# EAGLE design Bidirectional_Amp (EAGLE 9.5.1)

## Sheet 1 of 6: TX/RX Control
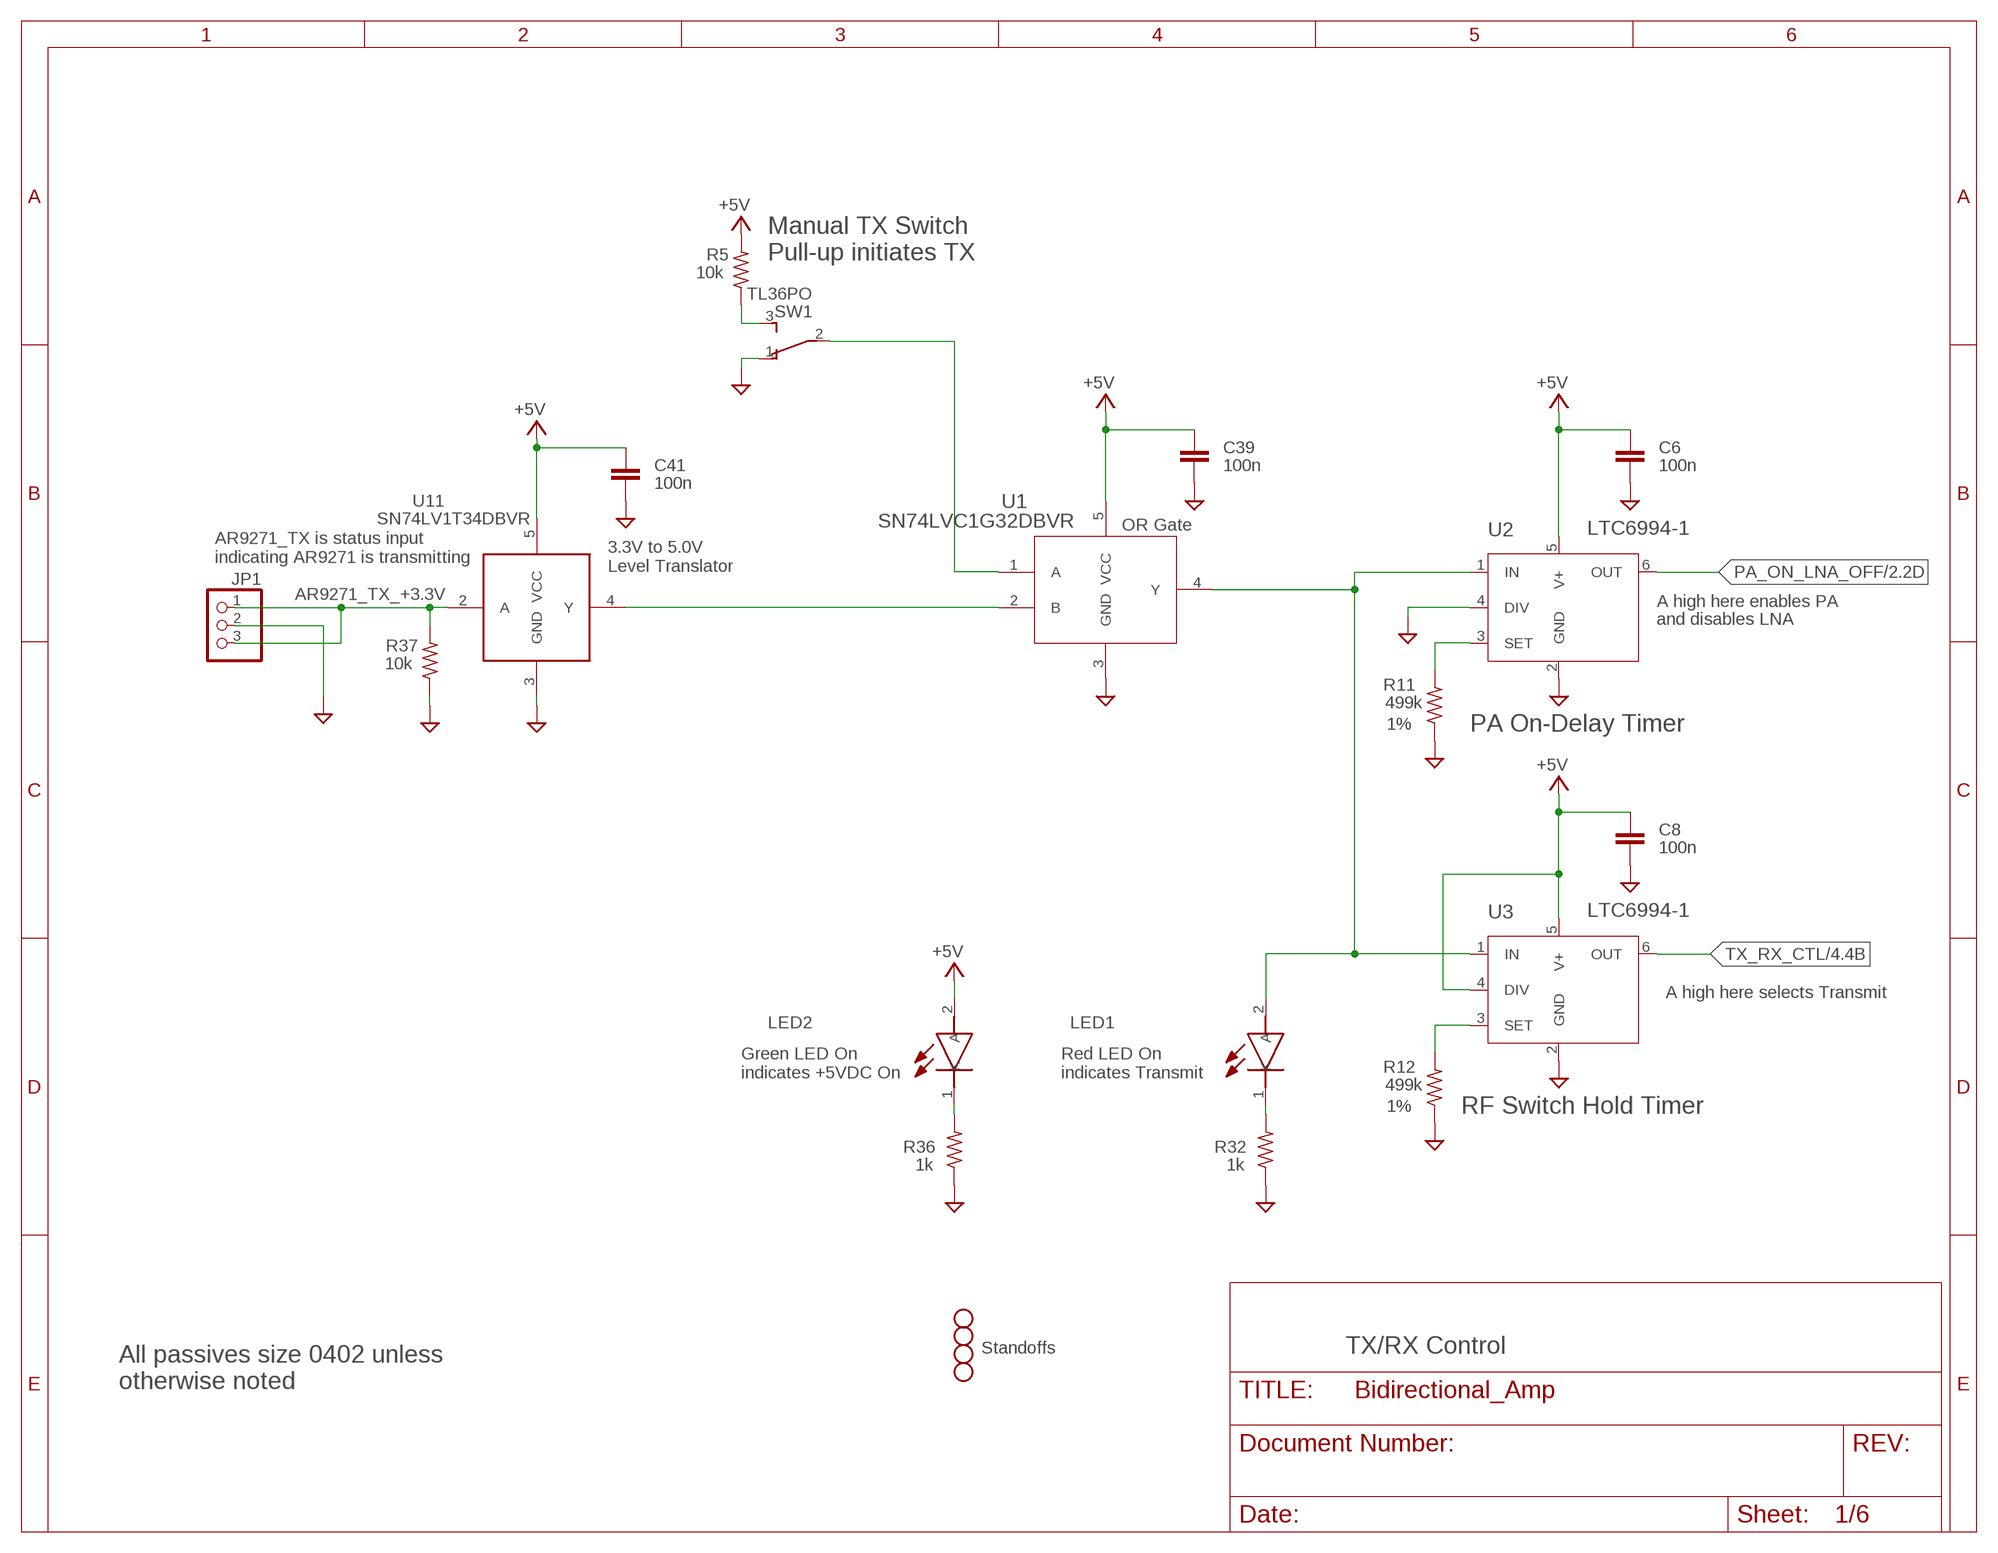
[diagram p0: schematic, sheet 1]

### Parts
C6  100n  C-EU0402-B-NOSILK  [.0402-B-NOSILK]
C8  100n  C-EU0402-B-NOSILK  [.0402-B-NOSILK]
C39  100n  C-EU0402-B-NOSILK  [.0402-B-NOSILK]
C41  100n  C-EU0402-B-NOSILK  [.0402-B-NOSILK]
H1  STAND-OFFTIGHT  [STAND-OFF-TIGHT]
H2  STAND-OFFTIGHT  [STAND-OFF-TIGHT]
H3  STAND-OFFTIGHT  [STAND-OFF-TIGHT]
H4  STAND-OFFTIGHT  [STAND-OFF-TIGHT]
JP1  PINHD-1X3  [1X03]
LED1  LTST-C193KRKT-5A  [LEDC1607X80N]
LED2  LTST-C193KGKT-5A  [LEDC1607X80N]
R5  10k  R-US_0402-B-NOSILK  [.0402-B-NOSILK]
R11  499k  R-US_0402-B-NOSILK  [.0402-B-NOSILK]
R12  499k  R-US_0402-B-NOSILK  [.0402-B-NOSILK]
R32  1k  R-US_0402-B-NOSILK  [.0402-B-NOSILK]
R36  1k  R-US_0402-B-NOSILK  [.0402-B-NOSILK]
R37  10k  R-US_0402-B-NOSILK  [.0402-B-NOSILK]
SW1  TL36PO  [TL3XPO]
U1  SN74LVC1G32DBVR  [DBV5]
U2  LTC6994-1  LTC6994CS6-1PBF  [TSOT-23_S6]
U3  LTC6994-1  LTC6994CS6-1PBF  [TSOT-23_S6]
U11  SN74LV1T34DBVR  [SOT95P280X145-5N]

### Nets
+5V: C6.1 C8.1 C39.1 C41.1 LED2.2(A) R5.2 U1.5(VCC) U2.5(V+) U3.4(DIV) U3.5(V+) U11.5(VCC) ; also sheet 2,3,4,5,6
AR9271_TX_+3.3V: JP1.1 JP1.3 R37.2 U11.2(A)
GND: C6.2 C8.2 C39.2 C41.2 JP1.2 R11.1 R12.1 R32.1 R36.1 R37.1 SW1.1(O) U1.3(GND) U2.2(GND) U2.4(DIV) U3.2(GND) U11.3(GND) ; also sheet 2,3,4,5,6
N$3: R5.1 SW1.3(S)
N$5: SW1.2(P) U1.1(A)
N$10: LED1.2(A) U1.4(Y) U2.1(IN) U3.1(IN)
N$11: R11.2 U2.3(SET)
N$13: U1.2(B) U11.4(Y)
N$14: R12.2 U3.3(SET)
N$15: LED1.1(K) R32.2
N$51: LED2.1(K) R36.2
PA_ON_LNA_OFF: U2.6(OUT) ; also sheet 2,3
TX_RX_CTL: U3.6(OUT) ; also sheet 4

### Notes on the sheet
- Manual TX Switch
  Pull-up initiates TX
- OR Gate
- AR9271_TX is status input
  indicating AR9271 is transmitting
- 3.3V to 5.0V
  Level Translator
- A high here enables PA
- and disables LNA
- 1% | PA On-Delay Timer
- A high here selects Transmit
- Green LED On
  indicates +5VDC On
- Red LED On
  indicates Transmit
- 1% | RF Switch Hold Timer
- Standoffs | TX/RX Control
- All passives size 0402 unless
  otherwise noted

## Sheet 2 of 6: Power Amplifier
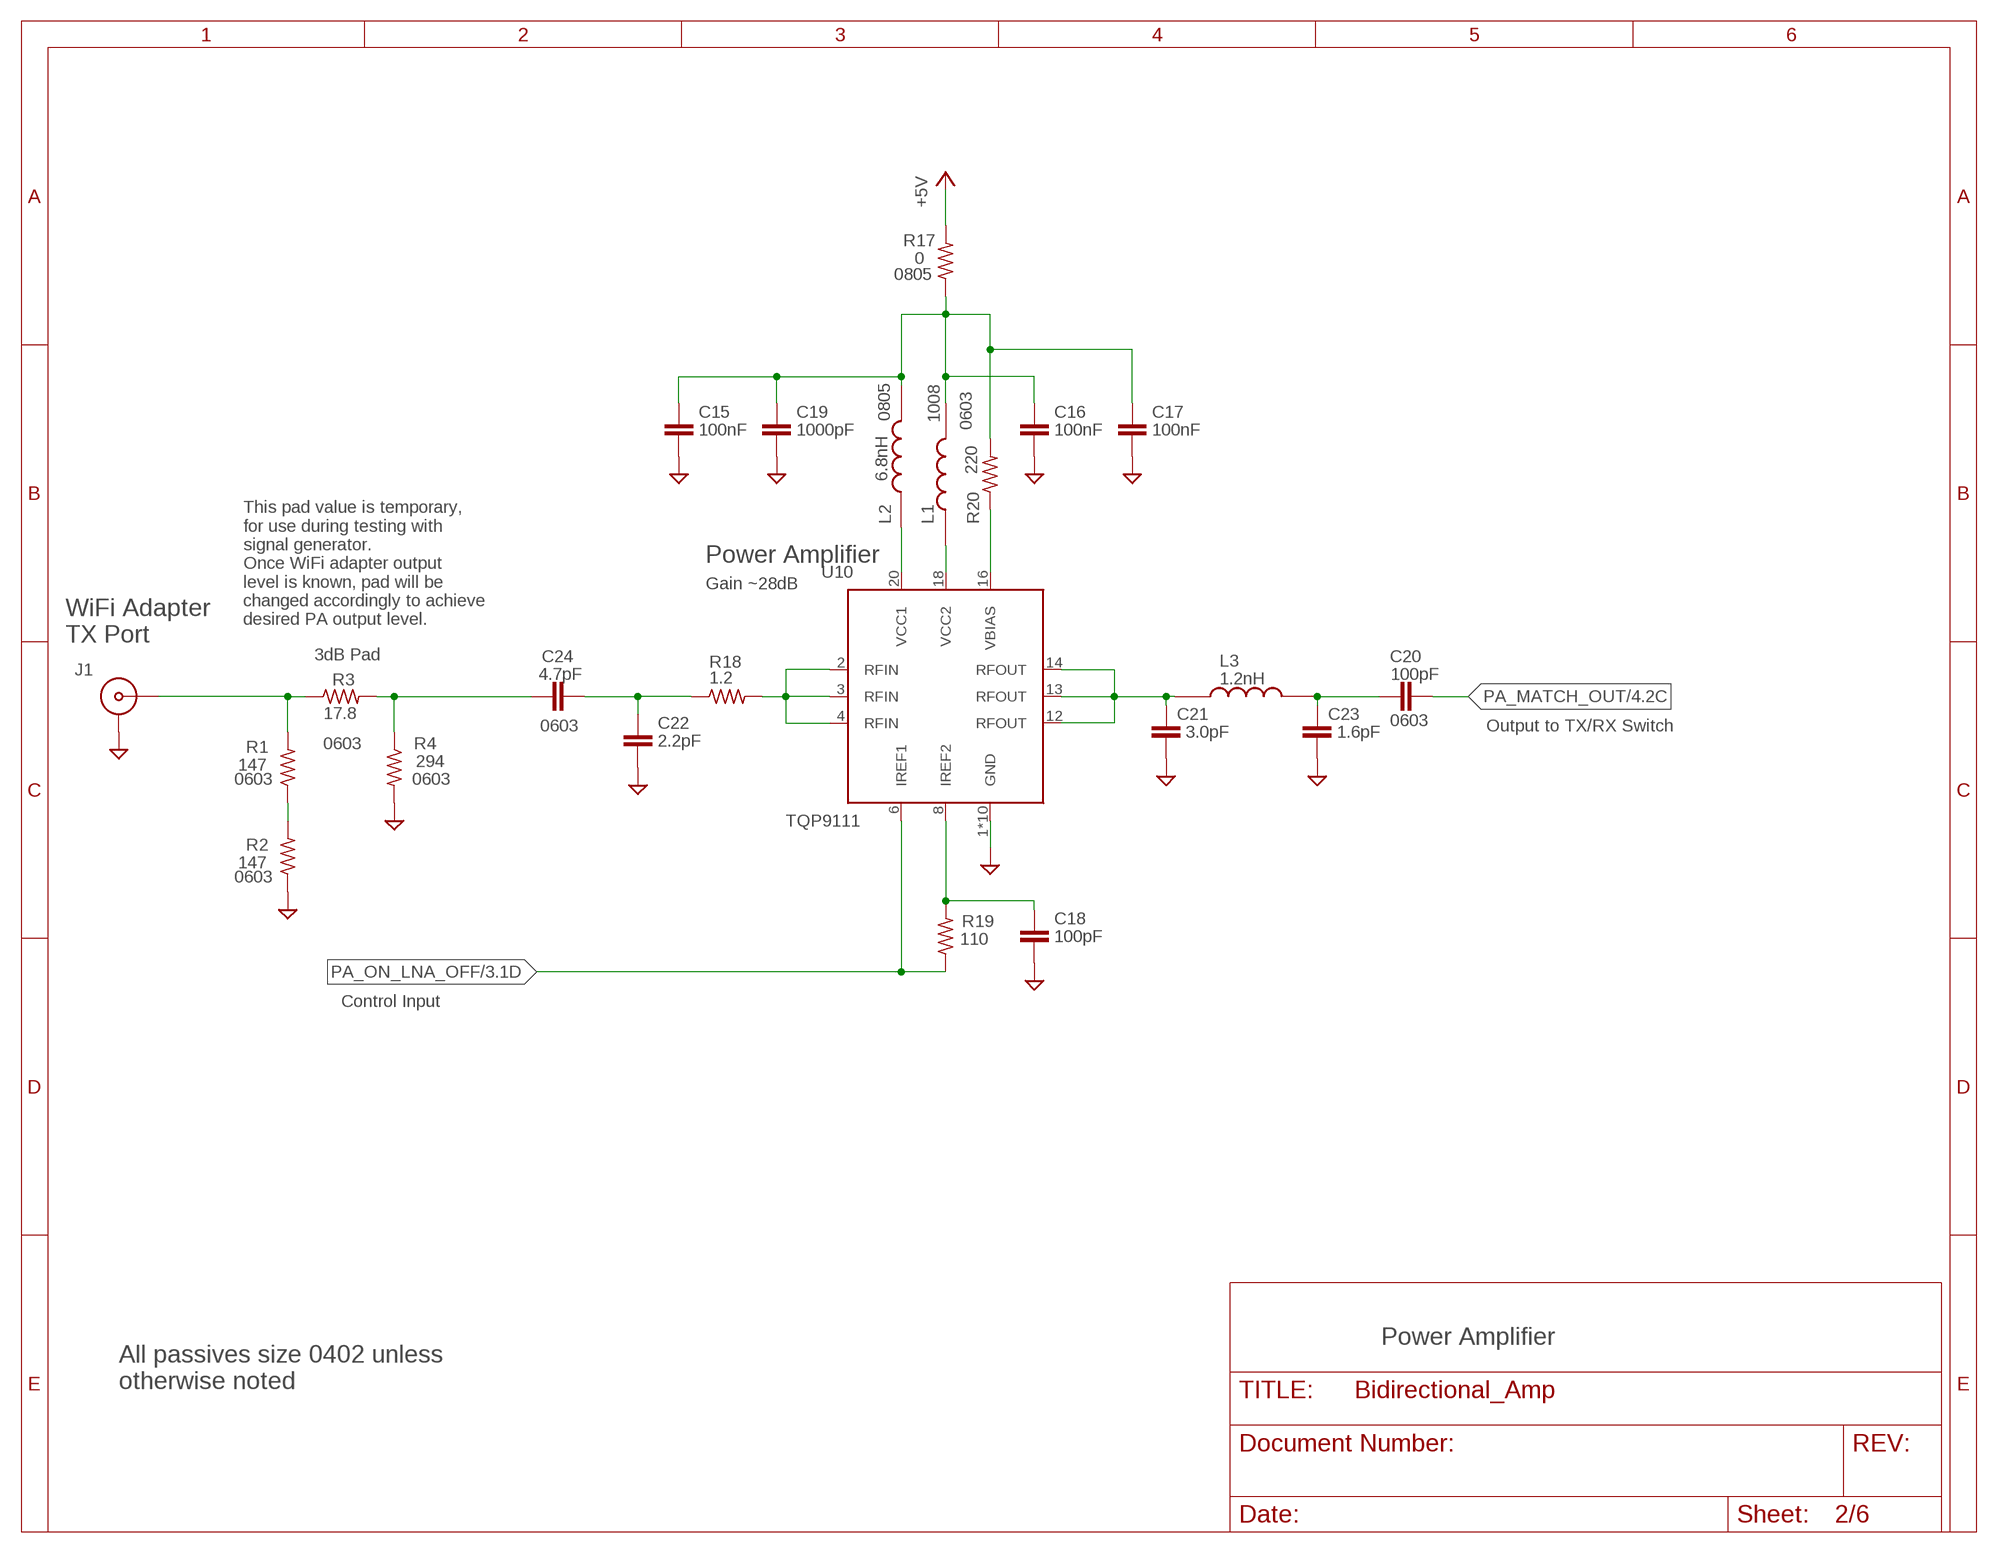
[diagram p1: schematic, sheet 2]

### Parts
C15  100nF  C-EU0402-B-NOSILK  [.0402-B-NOSILK]
C16  100nF  C-EU0402-B-NOSILK  [.0402-B-NOSILK]
C17  100nF  C-EU0402-B-NOSILK  [.0402-B-NOSILK]
C18  100pF  C-EU0402-B-NOSILK  [.0402-B-NOSILK]
C19  1000pF  C-EU0402-B-NOSILK  [.0402-B-NOSILK]
C20  100pF  C-EU0603-C-NOSILK  [.0603-C-NOSILK]
C21  3.0pF  C-EU0402-C-NOSILK  [.0402-C-NOSILK]
C22  2.2pF  C-EU0402-C-NOSILK  [.0402-C-NOSILK]
C23  1.6pF  C-EU0402-C-NOSILK  [.0402-C-NOSILK]
C24  4.7pF  C-EU0603-C-NOSILK  [.0603-C-NOSILK]
J1  142-0701-851_ALT  [142-0701-851]
L1  1008HQ-10NXJLB1008_IMPERIAL_2520_METRIC  [INDC2520X120N]
L2  6.8nH  0805CS-060XJLC  [0805CS]
L3  1.2nH  0402CS-1N2XJLW  [0402CS1N2XJLW]
R1  147  R-US_0603-C-NOSILK  [.0603-C-NOSILK]
R2  147  R-US_0603-C-NOSILK  [.0603-C-NOSILK]
R3  17.8  R-US_0603-C-NOSILK  [.0603-C-NOSILK]
R4  294  R-US_0603-C-NOSILK  [.0603-C-NOSILK]
R17  0  R-US_R0805  [R0805]
R18  1.2  R-US_R0402  [R0402]
R19  110  R-US_0402-B-NOSILK  [.0402-B-NOSILK]
R20  220  R-US_0603-C-NOSILK  [.0603-C-NOSILK]
U10  TQP9111  [QFN50P400X400X102-21N]

### Nets
+5V: R17.2 ; also sheet 1,3,4,5,6
GND: C15.2 C16.2 C17.2 C18.2 C19.2 C21.2 C22.2 C23.2 J1.GND1(GND) J1.GND2(GND) J1.GND3(GND) J1.GND4(GND) R2.1 R4.2 U10.1(GND) U10.5(GND) U10.7(GND) U10.9(GND) U10.10(GND) U10.11(GND) U10.15(GND) U10.17(GND) U10.19(GND) U10.21(GND) ; also sheet 1,3,4,5,6
N$2 [RF]: J1.RF1(CTR) R1.2 R3.1
N$4: R1.1 R2.2
N$16: L1.1 U10.18(VCC2)
N$21: C15.1 C16.1 C17.1 C19.1 L1.2 L2.2 R17.1 R20.2
N$22: C18.1 R19.2 U10.8(IREF2)
N$24 [RF]: C21.1 L3.1 U10.12(RFOUT) U10.13(RFOUT) U10.14(RFOUT)
N$25 [RF]: C22.1 C24.2 R18.1
N$27 [RF]: C20.1 C23.1 L3.2
N$30: R20.1 U10.16(VBIAS)
N$31: L2.1 U10.20(VCC1)
N$56 [RF]: R18.2 U10.2(RFIN) U10.3(RFIN) U10.4(RFIN)
PA_MATCH_OUT [RF]: C20.2 ; also sheet 4
PA_ON_LNA_OFF: R19.1 U10.6(IREF1) ; also sheet 1,3
PA_PAD_OUT [RF]: C24.1 R3.2 R4.1

### Notes on the sheet
- 0805
- 0805 | 1008
- 0603
- Power Amplifier
- Gain ~28dB
- This pad value is temporary,
  for use during testing with
  signal generator.
  Once WiFi adapter output
  level is known, pad will be
  changed accordingly to achieve
  desired PA output level.
- WiFi Adapter
  TX Port
- 3dB Pad
- 0603
- 0603 | Output to TX/RX Switch
- 0603
- 0603 | 0603
- 0603
- Control Input
- Power Amplifier
- All passives size 0402 unless
  otherwise noted

## Sheet 3 of 6: LNA and RX Bandpass Filters
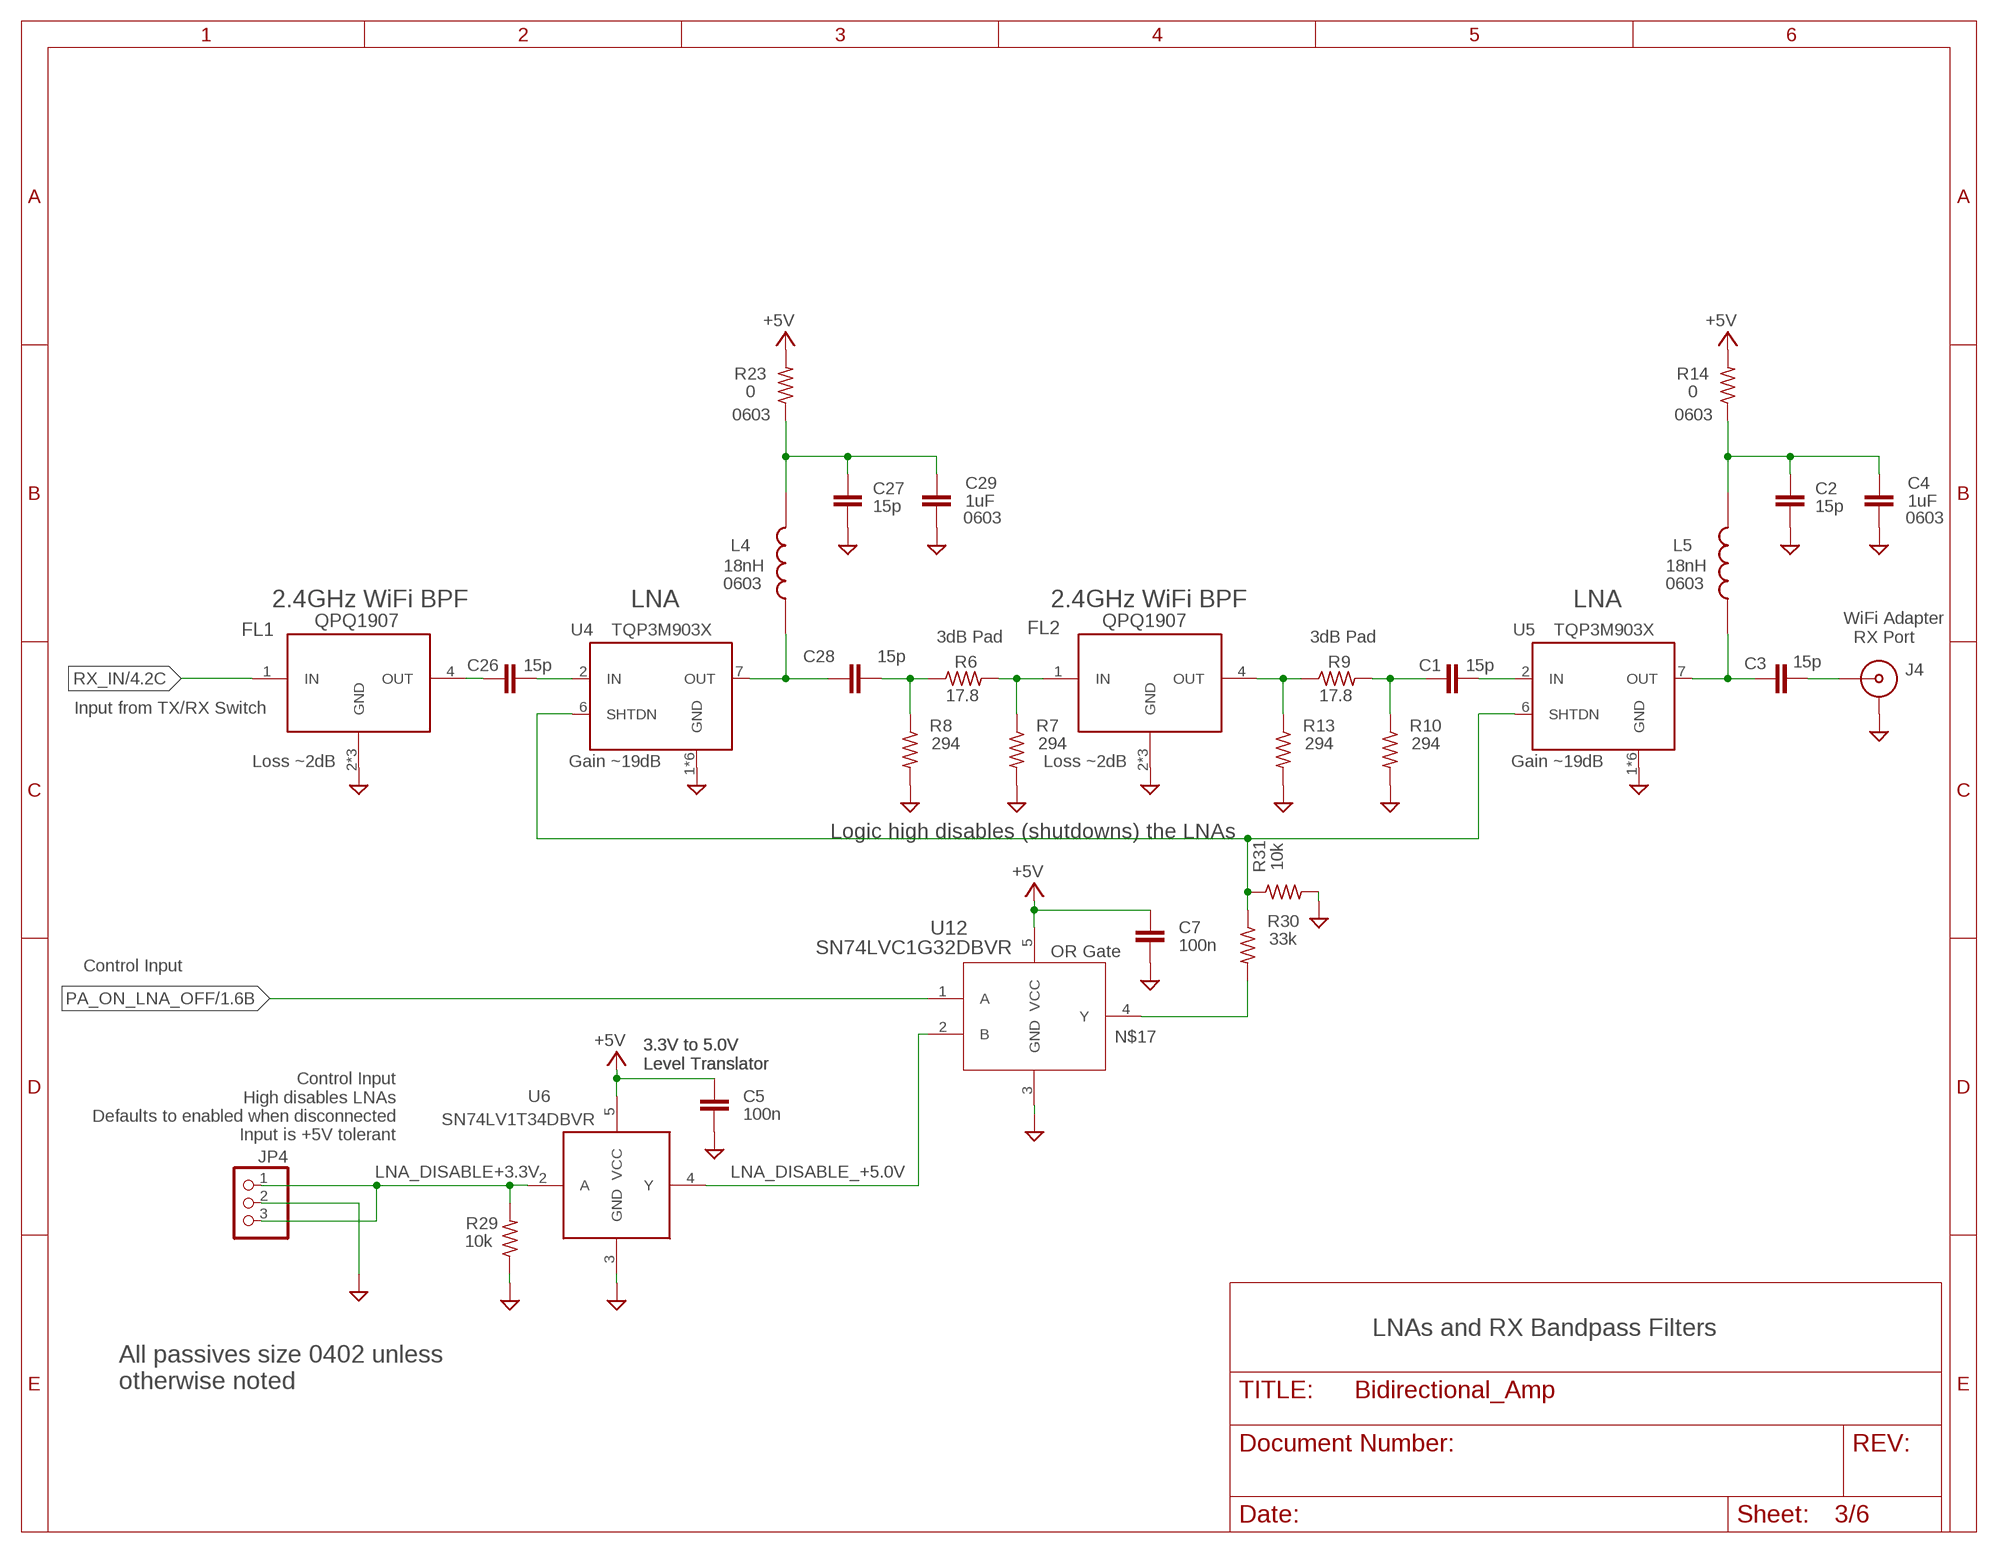
[diagram p2: schematic, sheet 3]

### Parts
C1  15p  C-EU0402-C-NOSILK  [.0402-C-NOSILK]
C2  15p  C-EU0402-B-NOSILK  [.0402-B-NOSILK]
C3  15p  C-EU0402-C-NOSILK  [.0402-C-NOSILK]
C4  1uF  C-EU0603-B-NOSILK  [.0603-B-NOSILK]
C5  100n  C-EU0402-B-NOSILK  [.0402-B-NOSILK]
C7  100n  C-EU0402-B-NOSILK  [.0402-B-NOSILK]
C26  15p  C-EU0402-C-NOSILK  [.0402-C-NOSILK]
C27  15p  C-EU0402-B-NOSILK  [.0402-B-NOSILK]
C28  15p  C-EU0402-C-NOSILK  [.0402-C-NOSILK]
C29  1uF  C-EU0603-B-NOSILK  [.0603-B-NOSILK]
FL1  QPQ1907  [FIL_B39162B9417K610]
FL2  QPQ1907  [FIL_B39162B9417K610]
J4  142-0701-851_ALT  [142-0701-851]
JP4  PINHD-1X3  [1X03]
L4  68nH  0603CS-68NXJLW  [0603CS-68NXJLW]
L5  68nH  0603CS-68NXJLW  [0603CS-68NXJLW]
R6  17.8  R-US_0402-C-NOSILK  [.0402-C-NOSILK]
R7  294  R-US_0402-C-NOSILK  [.0402-C-NOSILK]
R8  294  R-US_0402-C-NOSILK  [.0402-C-NOSILK]
R9  17.8  R-US_0402-C-NOSILK  [.0402-C-NOSILK]
R10  294  R-US_0402-C-NOSILK  [.0402-C-NOSILK]
R13  294  R-US_0402-C-NOSILK  [.0402-C-NOSILK]
R14  0  R-US_0603-B-NOSILK  [.0603-B-NOSILK]
R23  0  R-US_0603-B-NOSILK  [.0603-B-NOSILK]
R29  10k  R-US_0402-B-NOSILK  [.0402-B-NOSILK]
R30  33k  R-US_0402-B-NOSILK  [.0402-B-NOSILK]
R31  10k  R-US_0402-B-NOSILK  [.0402-B-NOSILK]
U4  TQP3M903X  [DFN8-2X2-WITH-PAD]
U5  TQP3M903X  [DFN8-2X2-WITH-PAD]
U6  SN74LV1T34DBVR  [SOT95P280X145-5N]
U12  SN74LVC1G32DBVR  [DBV5]

### Nets
+5V: C5.1 C7.1 R14.2 R23.2 U6.5(VCC) U12.5(VCC) ; also sheet 1,2,4,5,6
GND: C2.1 C4.2 C5.2 C7.2 C27.1 C29.2 FL1.2(GND) FL1.3(GND) FL1.5(GND) FL2.2(GND) FL2.3(GND) FL2.5(GND) J4.GND1(GND) J4.GND2(GND) J4.GND3(GND) J4.GND4(GND) JP4.2 R7.2 R8.2 R10.2 R13.2 R29.1 R31.2 U4.1(GND) U4.3(GND) U4.4(GND) U4.5(GND) U4.8(GND) U4.PAD(GND) U5.1(GND) U5.3(GND) U5.4(GND) U5.5(GND) U5.8(GND) U5.PAD(GND) U6.3(GND) U12.3(GND) ; also sheet 1,2,4,5,6
LNA_DISABLE+3.3V: JP4.1 JP4.3 R29.2 U6.2(A)
LNA_DISABLE_+5.0V: U6.4(Y) U12.2(B)
LNA_ON_OFF: R30.1 R31.1 U4.6(SHTDN) U5.6(SHTDN)
N$1 [RF]: C28.2 R6.1 R8.1
N$6 [RF]: FL2.4(OUT) R9.1 R13.1
N$7 [RF]: C1.2 U5.2(IN)
N$8 [RF]: C3.1 L5.1 U5.7(OUT)
N$9: C2.2 C4.1 L5.2 R14.1
N$12 [RF]: C3.2 J4.RF1(CTR)
N$17: R30.2 U12.4(Y)
N$26 [RF]: C26.2 U4.2(IN)
N$28 [RF]: C28.1 L4.1 U4.7(OUT)
N$29: C27.2 C29.1 L4.2 R23.1
N$33 [RF]: C26.1 FL1.4(OUT)
PA_ON_LNA_OFF: U12.1(A) ; also sheet 1,2
PA_PAD_OUT1 [RF]: FL2.1(IN) R6.2 R7.1
PA_PAD_OUT2 [RF]: C1.1 R9.2 R10.1
RX_IN [RF]: FL1.1(IN) ; also sheet 4

### Notes on the sheet
- 0603 | 0603
- 0603 | 0603
- 18nH | 18nH
- 0603 | 0603
- 2.4GHz WiFi BPF | LNA | 2.4GHz WiFi BPF | LNA
- 3dB Pad | 3dB Pad
- WiFi Adapter
    RX Port
- Input from TX/RX Switch
- Loss ~2dB | Gain ~19dB | Loss ~2dB | Gain ~19dB
- Logic high disables (shutdowns) the LNAs
- OR Gate
- Control Input
- 3.3V to 5.0V
  Level Translator
- 3.3V to 5.0V
  Level Translator
- Control Input
  High disables LNAs
  Defaults to enabled when disconnected
  Input is +5V tolerant
- LNAs and RX Bandpass Filters
- All passives size 0402 unless
  otherwise noted

## Sheet 4 of 6: TX/RX Switch
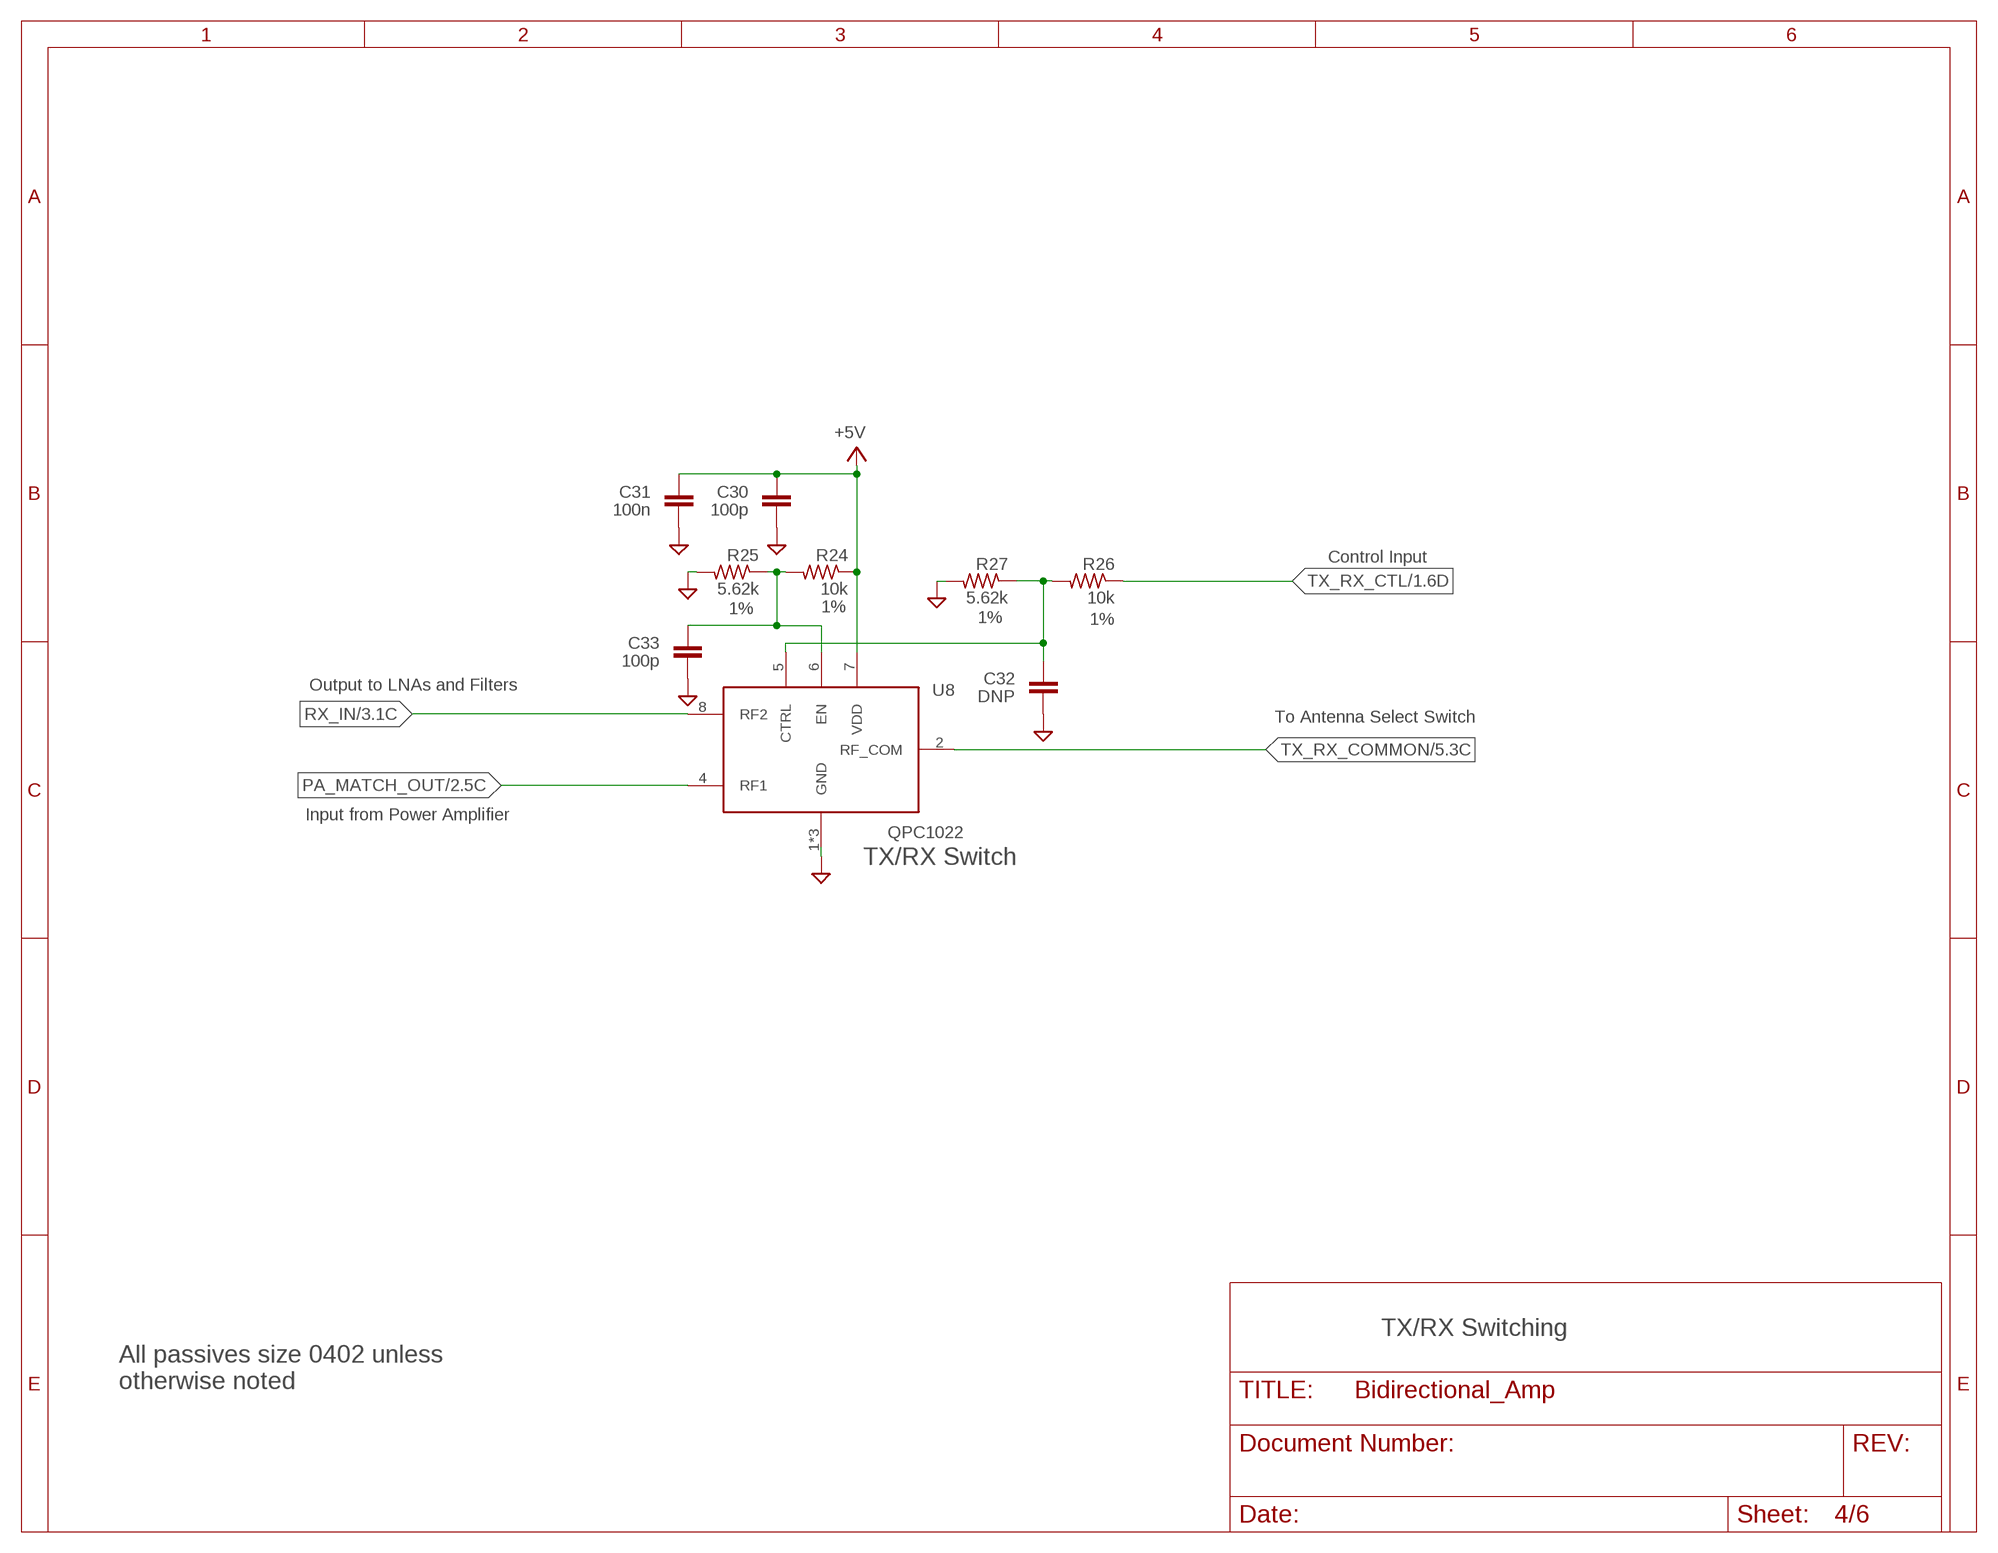
[diagram p3: schematic, sheet 4]

### Parts
C30  100p  C-EU0402-B-NOSILK  [.0402-B-NOSILK]
C31  100n  C-EU0402-B-NOSILK  [.0402-B-NOSILK]
C32  DNP  C-EU0402-B-NOSILK  [.0402-B-NOSILK]
C33  100p  C-EU0402-B-NOSILK  [.0402-B-NOSILK]
R24  10k  R-US_0402-B-NOSILK  [.0402-B-NOSILK]
R25  5.62k  R-US_0402-B-NOSILK  [.0402-B-NOSILK]
R26  10k  R-US_0402-B-NOSILK  [.0402-B-NOSILK]
R27  5.62k  R-US_0402-B-NOSILK  [.0402-B-NOSILK]
U8  QPC1022  [QPC1022]

### Nets
+5V: C30.1 C31.1 R24.1 U8.7(VDD) ; also sheet 1,2,3,5,6
GND: C30.2 C31.2 C32.2 C33.2 R25.2 R27.2 U8.1(GND) U8.3(GND) U8.9(GND) ; also sheet 1,2,3,5,6
PA_MATCH_OUT [RF]: U8.4(RF1) ; also sheet 2
RX_IN [RF]: U8.8(RF2) ; also sheet 3
TX_RX_COMMON [RF]: U8.2(RF_COM) ; also sheet 5
TX_RX_CTL: R26.1 ; also sheet 1
TXRX-CTRL: C32.1 R26.2 R27.1 U8.5(CTRL)
TXRX-EN: C33.1 R24.2 R25.1 U8.6(EN)

### Notes on the sheet
- Control Input
- 1% | 1%
- 1% | 1%
- Output to LNAs and Filters
- To Antenna Select Switch
- Input from Power Amplifier
- TX/RX Switch
- TX/RX Switching
- All passives size 0402 unless
  otherwise noted

## Sheet 5 of 6: Antenna Select Switch
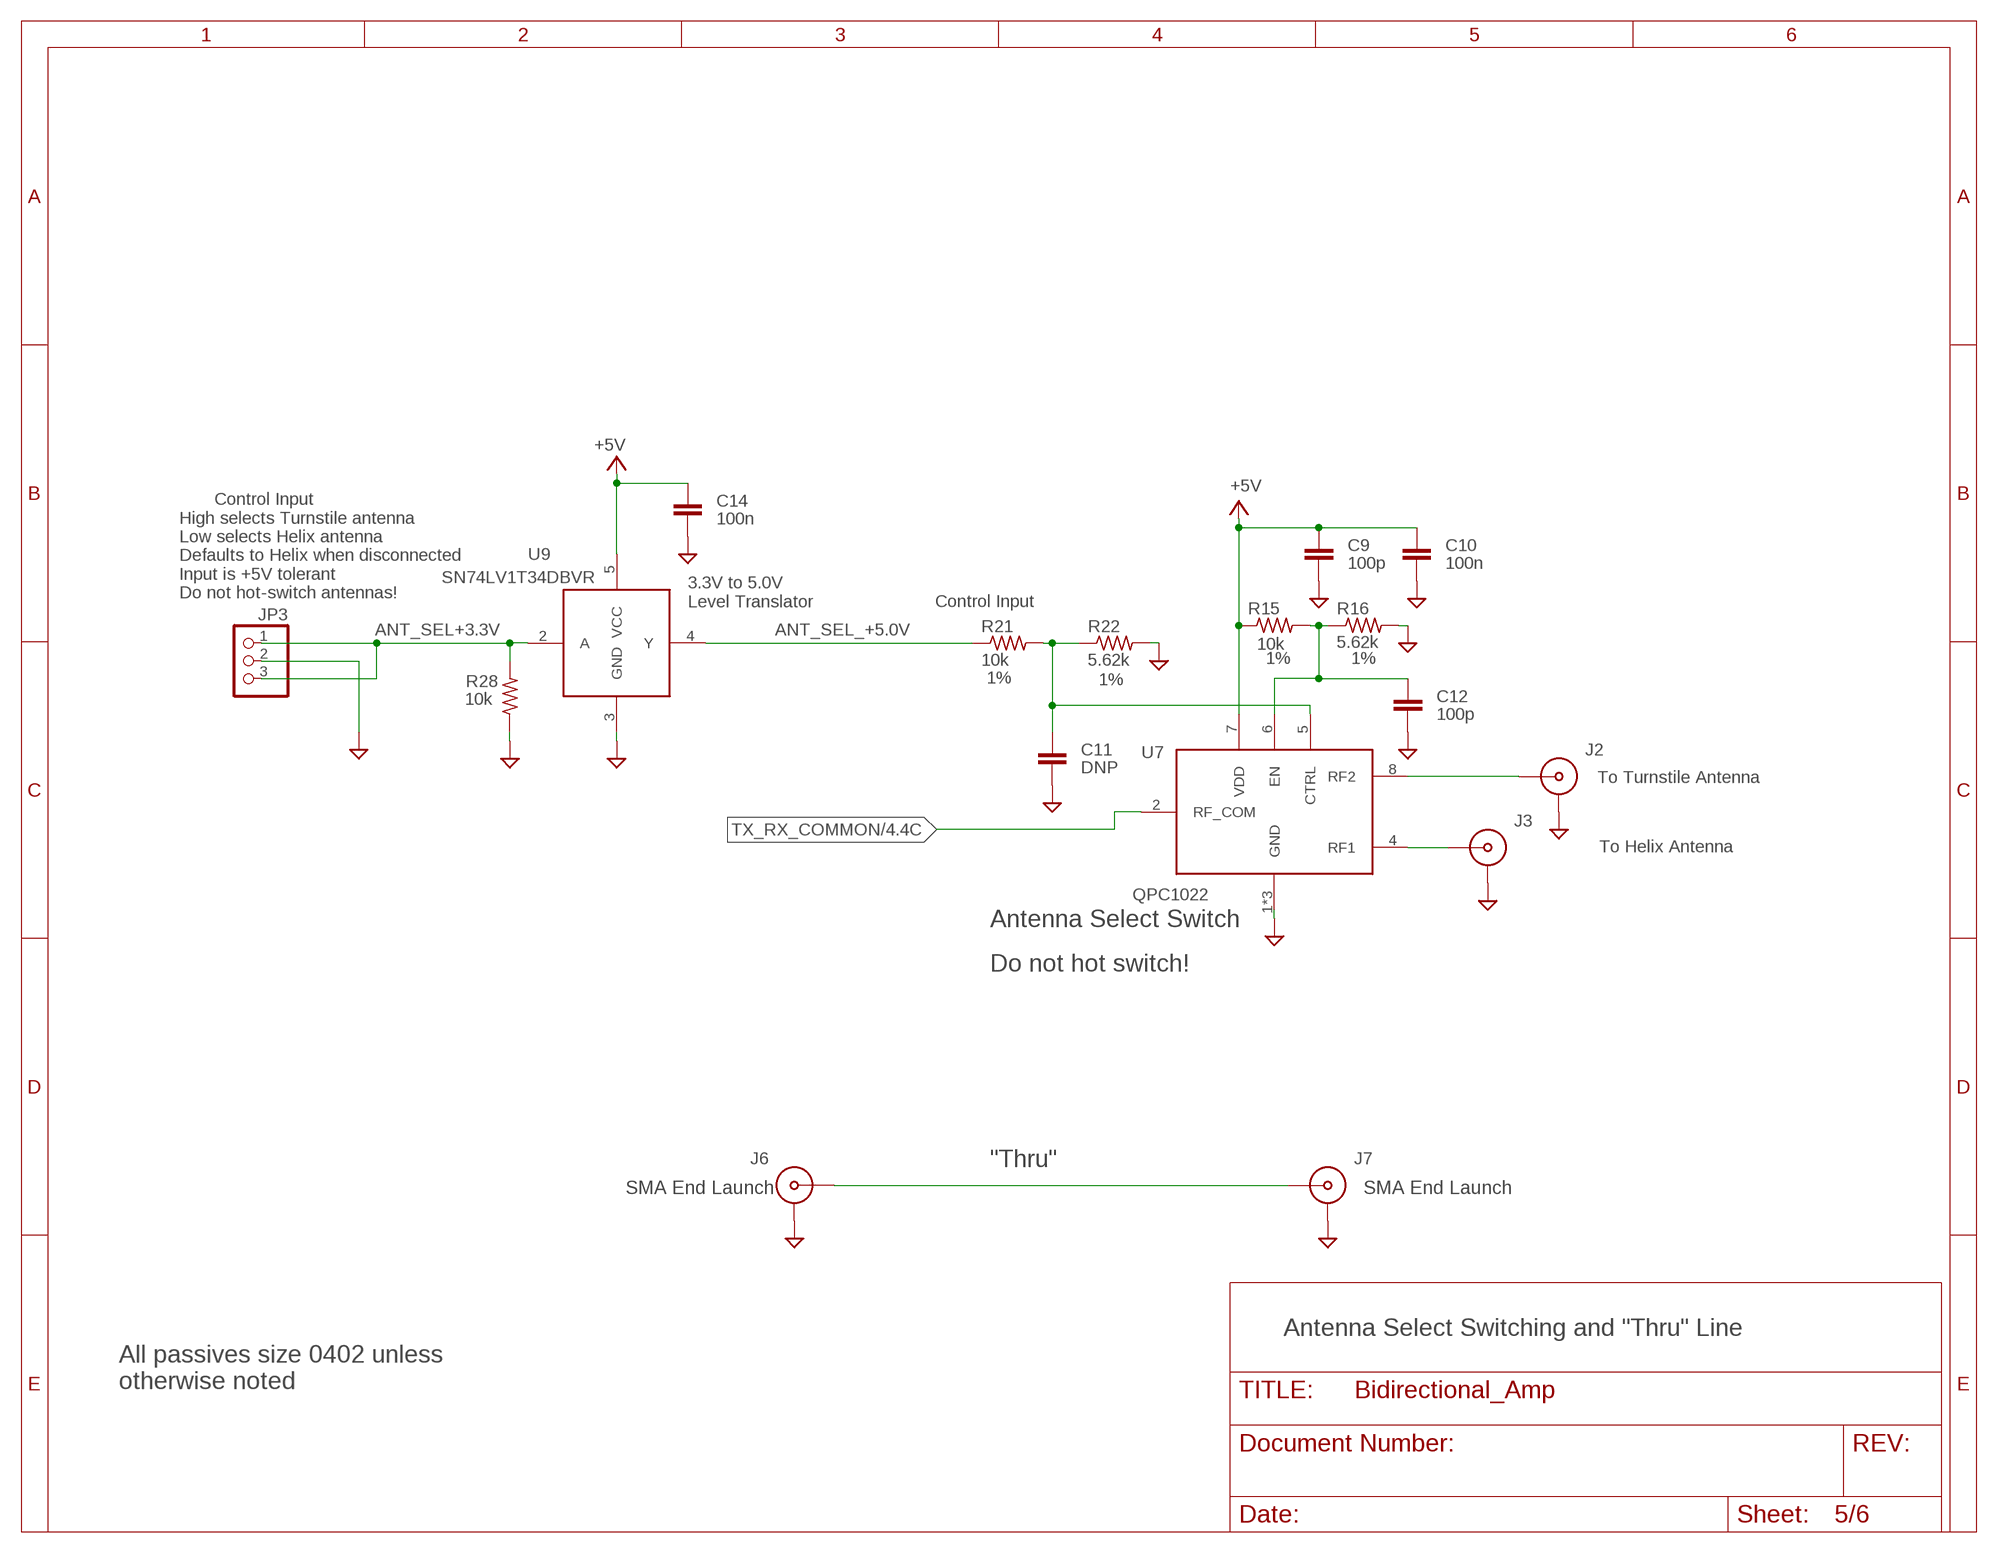
[diagram p4: schematic, sheet 5]

### Parts
C9  100p  C-EU0402-B-NOSILK  [.0402-B-NOSILK]
C10  100n  C-EU0402-B-NOSILK  [.0402-B-NOSILK]
C11  DNP  C-EU0402-B-NOSILK  [.0402-B-NOSILK]
C12  100p  C-EU0402-B-NOSILK  [.0402-B-NOSILK]
C14  100n  C-EU0402-B-NOSILK  [.0402-B-NOSILK]
J2  142-0701-851_ALT  [142-0701-851]
J3  142-0701-851_ALT  [142-0701-851]
J6  142-0701-851_ALT  [142-0701-851]
J7  142-0701-851_ALT  [142-0701-851]
JP3  PINHD-1X3  [1X03]
R15  10k  R-US_0402-B-NOSILK  [.0402-B-NOSILK]
R16  5.62k  R-US_0402-B-NOSILK  [.0402-B-NOSILK]
R21  10k  R-US_0402-B-NOSILK  [.0402-B-NOSILK]
R22  5.62k  R-US_0402-B-NOSILK  [.0402-B-NOSILK]
R28  10k  R-US_0402-B-NOSILK  [.0402-B-NOSILK]
U7  QPC1022  [QPC1022]
U9  SN74LV1T34DBVR  [SOT95P280X145-5N]

### Nets
+5V: C9.1 C10.1 C14.1 R15.1 U7.7(VDD) U9.5(VCC) ; also sheet 1,2,3,4,6
ANT_SEL+3.3V: JP3.1 JP3.3 R28.2 U9.2(A)
ANT_SEL_+5.0V: R21.1 U9.4(Y)
AS-CTRL: C11.1 R21.2 R22.1 U7.5(CTRL)
AS-EN: C12.1 R15.2 R16.1 U7.6(EN)
GND: C9.2 C10.2 C11.2 C12.2 C14.2 J2.GND1(GND) J2.GND2(GND) J2.GND3(GND) J2.GND4(GND) J3.GND1(GND) J3.GND2(GND) J3.GND3(GND) J3.GND4(GND) J6.GND1(GND) J6.GND2(GND) J6.GND3(GND) J6.GND4(GND) J7.GND1(GND) J7.GND2(GND) J7.GND3(GND) J7.GND4(GND) JP3.2 R16.2 R22.2 R28.1 U7.1(GND) U7.3(GND) U7.9(GND) U9.3(GND) ; also sheet 1,2,3,4,6
HELICAL [RF]: J2.RF1(CTR) U7.8(RF2)
THROUGH [RF]: J6.RF1(CTR) J7.RF1(CTR)
TURNSTILE [RF]: J3.RF1(CTR) U7.4(RF1)
TX_RX_COMMON [RF]: U7.2(RF_COM) ; also sheet 4

### Notes on the sheet
- Control Input
  High selects Turnstile antenna
  Low selects Helix antenna
  Defaults to Helix when disconnected
  Input is +5V tolerant
  Do not hot-switch antennas!
- 3.3V to 5.0V
  Level Translator
- Control Input
- 1% | 1%
- 1% | 1%
- To Turnstile Antenna
- To Helix Antenna
- Antenna Select Switch
- Do not hot switch!
- "Thru"
- SMA End Launch | SMA End Launch
- Antenna Select Switching and "Thru" Line
- All passives size 0402 unless
  otherwise noted

## Sheet 6 of 6: Power
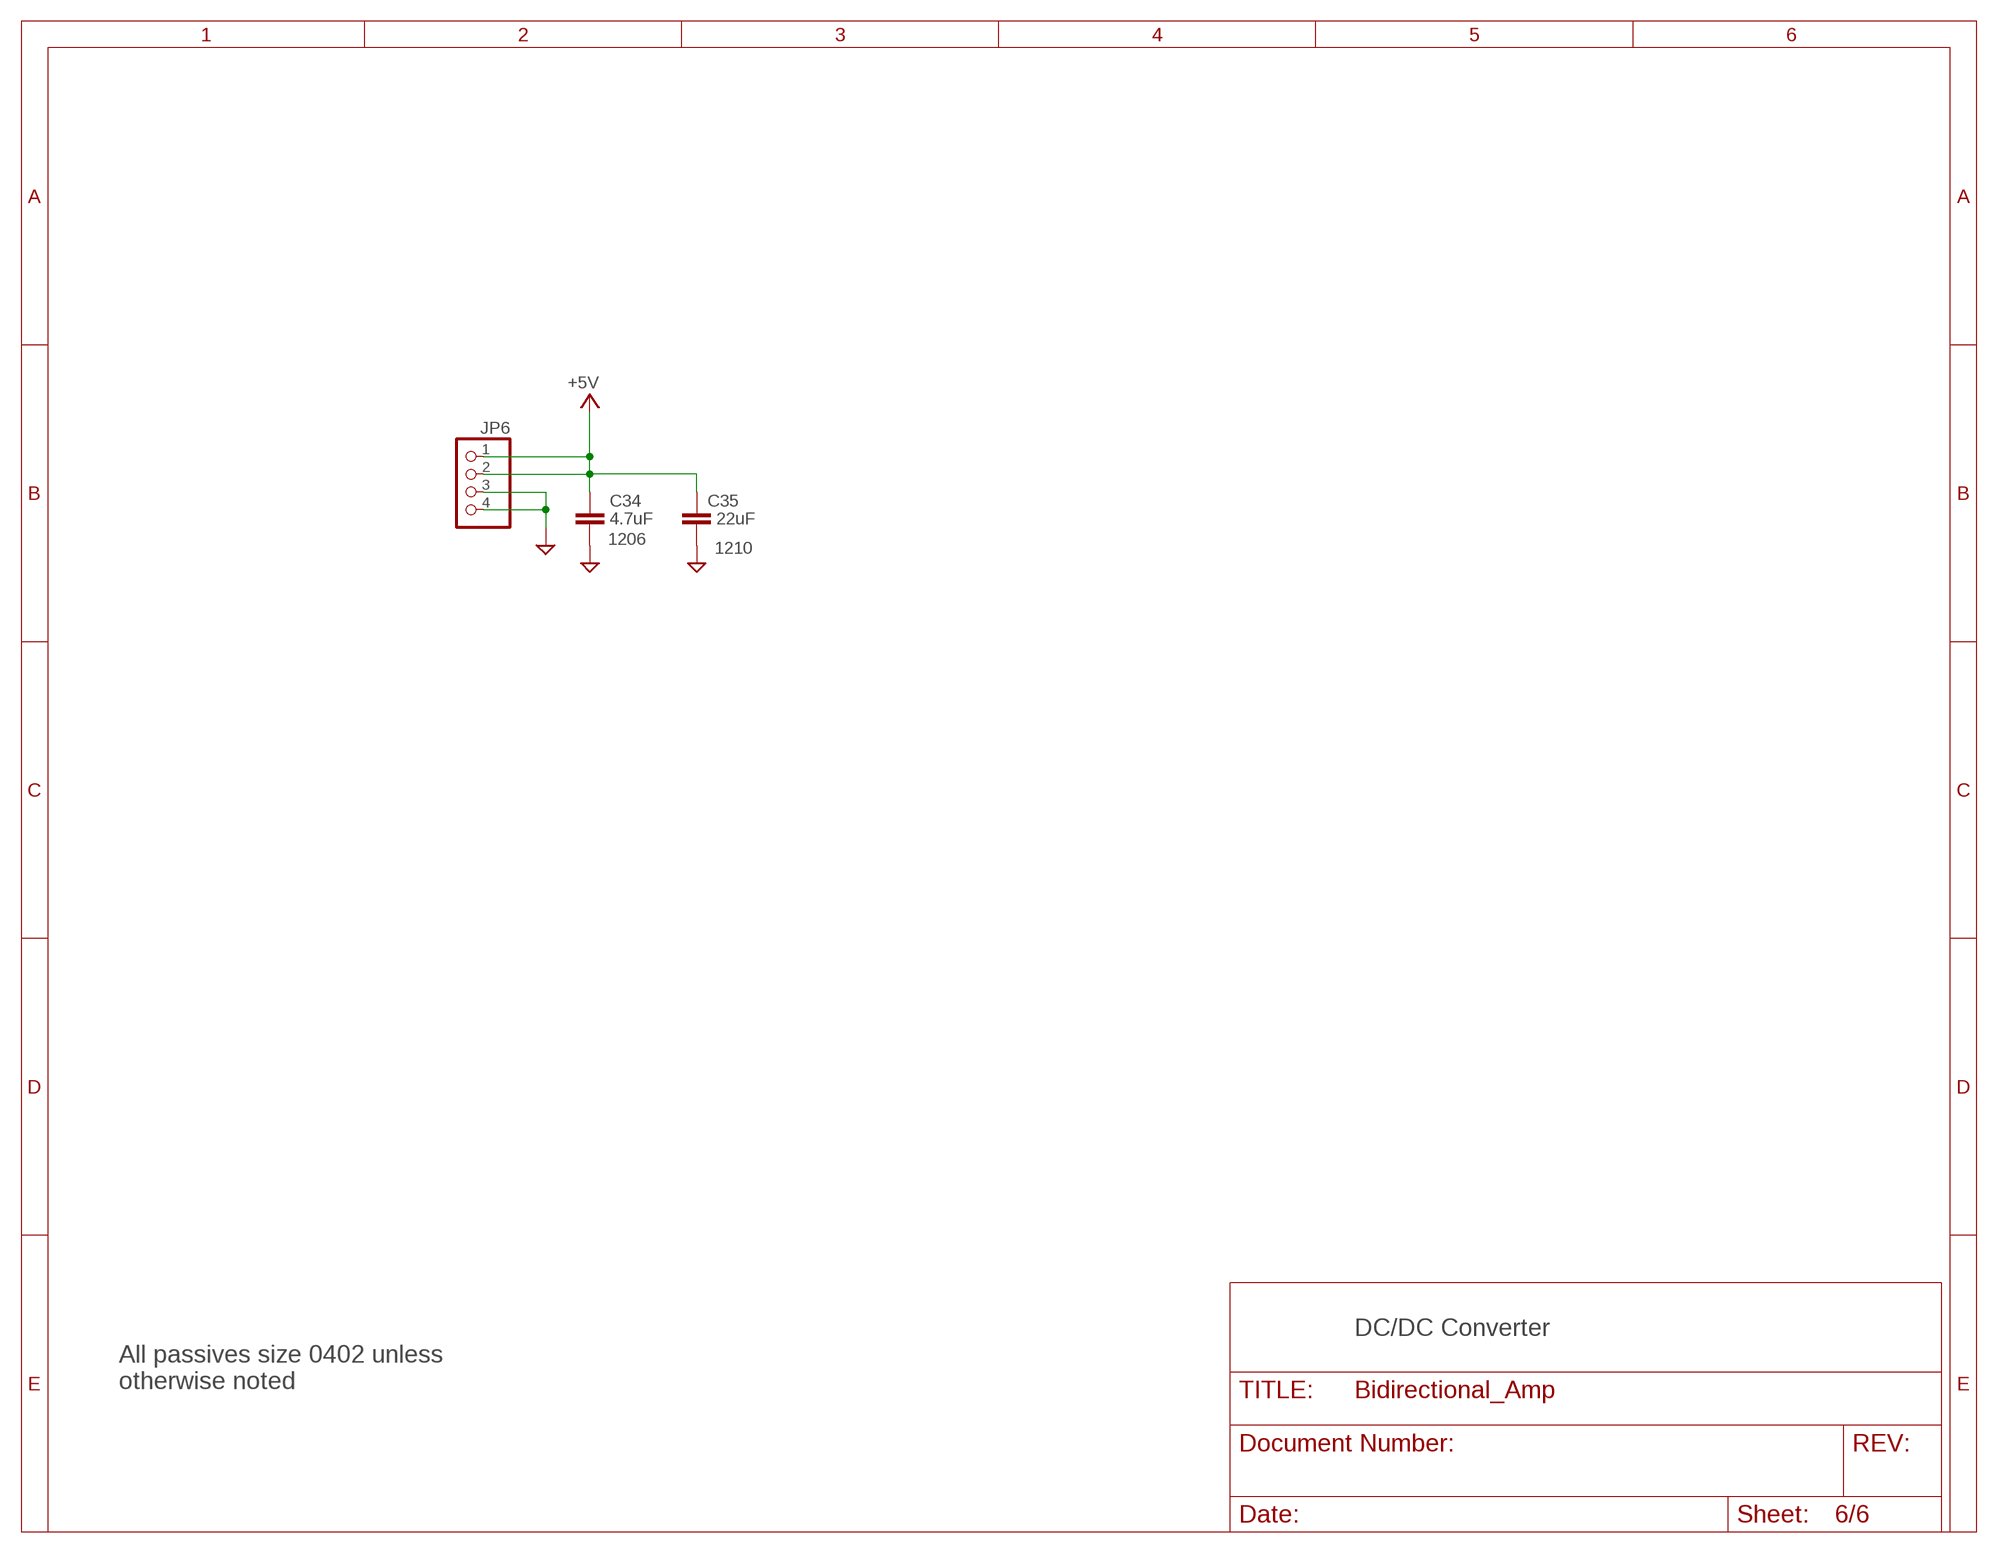
[diagram p5: schematic, sheet 6]

### Parts
C34  4.7uF  C-EUC1206  [C1206]
C35  22uF  C-EUC1210  [C1210]
JP6  PINHD-1X4  [1X04]

### Nets
+5V: C34.1 C35.1 JP6.1 JP6.2 ; also sheet 1,2,3,4,5
GND: C34.2 C35.2 JP6.3 JP6.4 ; also sheet 1,2,3,4,5

### Notes on the sheet
- 1206
- 1210
- DC/DC Converter
- All passives size 0402 unless
  otherwise noted

## Library data of the parts
C1-C3 C26-C28 = oresat-rcl:C-EU: CAPACITOR, European symbol; MFR: Murata; MPN: GJM1555C1H150JB01D
C4 C29 = oresat-rcl:C-EU: CAPACITOR, European symbol; MFR: KEMET; MPN: C0603X105M4RACAUTO
C5 C10 C14 C31 = oresat-rcl:C-EU: CAPACITOR, European symbol; MFR: TDK Corporation; MPN: CGA2B1X7R1C104K050BC
C6-C8 C15-C17 C39 C41 = oresat-rcl:C-EU: CAPACITOR, European symbol; MFR: TDK; MPN: CGA2B1X7R1C104K050BC
C9 C18 C30 C33 = oresat-rcl:C-EU: CAPACITOR, European symbol; MFR: Murata; MPN: GCM1555C1H101JA16D
C11 C12 = oresat-rcl:C-EU: CAPACITOR, European symbol; MPN: GCM1555C1H101JA16D
C19 = oresat-rcl:C-EU: CAPACITOR, European symbol; MFR: TDK; MPN: CGA2B2NP01H102J050BA
C20 = oresat-rcl:C-EU: CAPACITOR, European symbol; MFR: Murata; MPN: GCM1885C1H101JA16D
C21 = oresat-rcl:C-EU: CAPACITOR, European symbol; MFR: Taiyo Yuden; MPN: UVK105CG030JW-F
C22 = oresat-rcl:C-EU: CAPACITOR, European symbol; MFR: Taiyo Yuden; MPN: UVK105CG2R2JW-F
C23 = oresat-rcl:C-EU: CAPACITOR, European symbol; MFR: Murata; MPN: GJM1555C1H1R6BB01D
C24 = oresat-rcl:C-EU: CAPACITOR, European symbol; MFR: AVX Corp.; MPN: 06032U4R7BAT2A
C32 = oresat-rcl:C-EU: CAPACITOR, European symbol
C34 = rcl:C-EU: CAPACITOR, European symbol; MFR: Murata; MPN: GCJ31CR71C475KA01L; SIZE: 1206; SPICEPREFIX: C; VOLTAGE: 16V
C35 = rcl:C-EU: CAPACITOR, European symbol; MFR: Murata; MPN: GCJ32ER71C226KE01L; SPICEPREFIX: C
FL1 FL2 = U-Qorvo-QPQ1907-2.4GHz-BPF:QPQ1907: 2.4GHz BPF; MFR: Qorvo; MPN: QPQ1907
H1-H4 = SparkFun-Hardware:STAND-OFF: Stand Off Drill holes for mechanically mounting via screws, standoffs, etc. Note: Use the keepout ring to avoid running the screw head into surrounding components. Variant Overviews STAND-OFF - Mechanical footprint for a #4 phillips button head screw. STAND-OFF-TIGHT - Mechanical footprint for a #4 phillips button head screw, Example SparkFun Products Screw - Phillips Head (1/4", 4-40, 10 pack) <https://www.sparkfun.com/products/10453> (PRT-10453) Screw - Phillips Head (1/2", 4-40, 10 pack) <https://www.sparkfun.com/products/10452> (PRT-10452) Screw - Phillips Head (3/4", 4-40, 10 pack) <https://www.sparkfun.com/products/10451> (PRT-10451) Screw - Phillips Head (1", 4-40, 10 pack) <https://www.sparkfun.com/products/10450> (PRT-10450)
J1-J4 J6 J7 = J-Cinch-142-0701-851-SMA-end-launch:142-0701-851_ALT: SMA Jack 50Ω - End Launch This is a more common symbol for coax connectors; MFR: Cinch; MPN: 142-0701-851
JP1 JP3 JP4 = pinhead:PINHD-1X3: PIN HEADER; MFR: Molex; MPN: 22-23-2031
JP6 = pinhead:PINHD-1X4: PIN HEADER
L1 = SamacSys_Parts:1008HQ-10NXJLB: Fixed Inductors 1008HQ 10 nH 5 % 1.6 A; MFR: COILCRAFT; MPN: 1008HQ-10NXJLB
L2 = SamacSys_Parts:0805CS-060XJLC: Fixed Inductors 0805CS Ceramic Chip 6.8 nH 5 % 0.6 A; DESCRIPTION: Fixed Inductors 0805CS Ceramic Chip 6.8 nH 5 % 0.6 A; HEIGHT: mm; MFR: COILCRAFT; MPN: 0805CS-060XJLC
L3 = SamacSys_Parts:0402CS-1N2XJLW: RF inductor, ceramic core, 5% tol, SMT, RoHS, halogen-free Source: Datasheet <https://www.coilcraft.com/misc/0402csd.html>; DESCRIPTION: RF inductor, ceramic core, 5% tol, SMT, RoHS, halogen-free; HEIGHT: 0mm; MFR: COILCRAFT; MPN: 0402CS-1N2XJLW
L4 L5 = SamacSys_Parts:0603CS-68NXJLW: Fixed Inductors 0603CS High Q, 68nH 0.6A Source: Datasheet <https://www.coilcraft.com/pdfs/0603cs.pdf>; HEIGHT: 1mm; MFR: COILCRAFT; MPN: 0603CS-18NXJLW
LED1 = SamacSys_Parts:LTST-C193KRKT-5A: LED,SMD,0603,Red, Lite-On LTST-C193KRKT-5A Red LED, 631 nm, 1608 (0603), Rectangle Lens SMD Package Source: Datasheet <http://docs-europe.electrocomponents.com/webdocs/0dc0/0900766b80dc02a7.pdf>; DESCRIPTION: LED,SMD,0603,Red,Lite-On 1608 (0603), Rectangle Lens SMD Package; MFR: Lite-On; MPN: LTST-C193KRKT-5A
LED2 = SamacSys_Parts:LTST-C193KGKT-5A: LED,SMD,0603,Green, Lite-On LTST-C193KGKT-5A 1608 (0603), Rectangle Lens SMD Package Source: Datasheet <http://docs-europe.electrocomponents.com/webdocs/0dc0/0900766b80dc02a7.pdf>; DESCRIPTION: LED,SMD,0603,Green,Lite-On 1608 (0603), Rectangle Lens SMD Package; MFR: Lite-On; MPN: LTST-C193KGKT-5A
R1 R2 = oresat-rcl:R-US_: RESISTOR, American symbol; MFR: Panasonic; MPN: ERJ-3EKF1470V
R3 = oresat-rcl:R-US_: RESISTOR, American symbol; MFR: Panasonic; MPN: ERJ-3EKF17R8V
R4 = oresat-rcl:R-US_: RESISTOR, American symbol; MFR: Panasonic; MPN: ERJ-3EKF2940V
R5 R28 R29 R37 = oresat-rcl:R-US_: RESISTOR, American symbol; MFR: Panasonic; MPN: ERJ-2GEJ103X
R6 R9 = oresat-rcl:R-US_: RESISTOR, American symbol; MFR: Panasonic; MPN: ERJ-2RKF17R8X
R7 R8 R10 R13 R30 R31 = oresat-rcl:R-US_: RESISTOR, American symbol; MFR: Panasonic; MPN: ERJ-2RKF2940X
R11 R12 = oresat-rcl:R-US_: RESISTOR, American symbol; MFR: Panasonic; MPN: ERJ-2RKF4993X
R14 R23 = oresat-rcl:R-US_: RESISTOR, American symbol; MFR: Panasonic; MPN: ERJ-3GEY0R00V
R15 R21 R24 R26 = oresat-rcl:R-US_: RESISTOR, American symbol; MFR: Panasonic; MPN: ERJ-2RKF1002X
R16 R22 R25 R27 = oresat-rcl:R-US_: RESISTOR, American symbol; MFR: Panasonic; MPN: ERJ-2RKF5621X
R17 = rcl:R-US_: RESISTOR, American symbol; MFR: Panasonic; MPN: ERJ-6GEY0R00V; SPICEPREFIX: R
R18 = rcl:R-US_: RESISTOR, American symbol; MFR: Panasonic; MPN: ERJ-2GEJ1R2X; SPICEPREFIX: R
R19 = oresat-rcl:R-US_: RESISTOR, American symbol; MFR: Panasonic; MPN: ERJ-2RKF1100X
R20 = oresat-rcl:R-US_: RESISTOR, American symbol; MFR: Panasonic; MPN: ERJ-3EKF2200V
R32 R36 = oresat-rcl:R-US_: RESISTOR, American symbol; MFR: Panasonic; MPN: ERJ-2GEJ102X
SW1 = switch:TL36PO: TINY SWITCH ON - ON Source: http://www2.produktinfo.conrad.com/datenblaetter/700000-724999/705152-da-01-de-Subminiaturschalter_TL_36YO.pdf; MFR: APEM Inc.; MPN: TL36P005000
U1 U12 = SN74LVC1G32DBVR:SN74LVC1G32DBVR; MFR: Texas Instruments; MPN: SN74LVC1G32DBVR
U2 U3 = U-Linear-LTC6994CS6-1-programable-delay:LTC6994CS6-1PBF; MFR: Linear Technology; MPN: LTC6994-1
U4 U5 = U-Qorvo-TQP3M903x-LNA:TQP3M903X: Ultra Low Noise, High Linearity LNAs TQP3M9035: 0.05 - 6.0 GHz Operational Bandwidth Source: Datasheet <https://www.qorvo.com/products/p/TQP3M9035> TQP3M9036: 0.1 - 2.0 GHz Operational Bandwidth Source: Datasheet <https://www.qorvo.com/products/p/TQP3M9036> TQP3M9037: 0.7 - 6.0 GHz Operational Bandwidth Source: Datasheet <https://www.qorvo.com/products/p/TQP3M9037>; MFR: Qorvo; MPN: TQP3M9037
U6 U9 U11 = SamacSys_Parts:SN74LV1T34DBVR: Single Power Supply BUFFER Logic Level Shifter (no enable) Source: Datasheet <http://www.ti.com/lit/gpn/sn74lv1t34>; DESCRIPTION: Single Power Supply BUFFER Logic Level Shifter (no enable); MFR: Texas Instruments; MPN: SN74LV1T34DBVR
U7 U8 = U-Qorvo-QPC1022-RF-SPDT-switch:QPC1022; MFR: Qorvo; MPN: QPC1022
U10 = oresat-samacsys_Parts:TQP9111: RF Amplifier 1.8-2.7GHz Gn 29.8dB P1dB 32.5dBm 2 stage Source: Datasheet <https://componentsearchengine.com/Datasheets/1/TQP9111.pdf>; DESCRIPTION: RF Amplifier 1.8-2.7GHz Gn 29.8dB P1dB 32.5dBm 2 stage; HEIGHT: 1.02mm; MFR: Qorvo; MPN: TQP9111

## Net classes
1 RF: clearance 0.75 mm

## Board
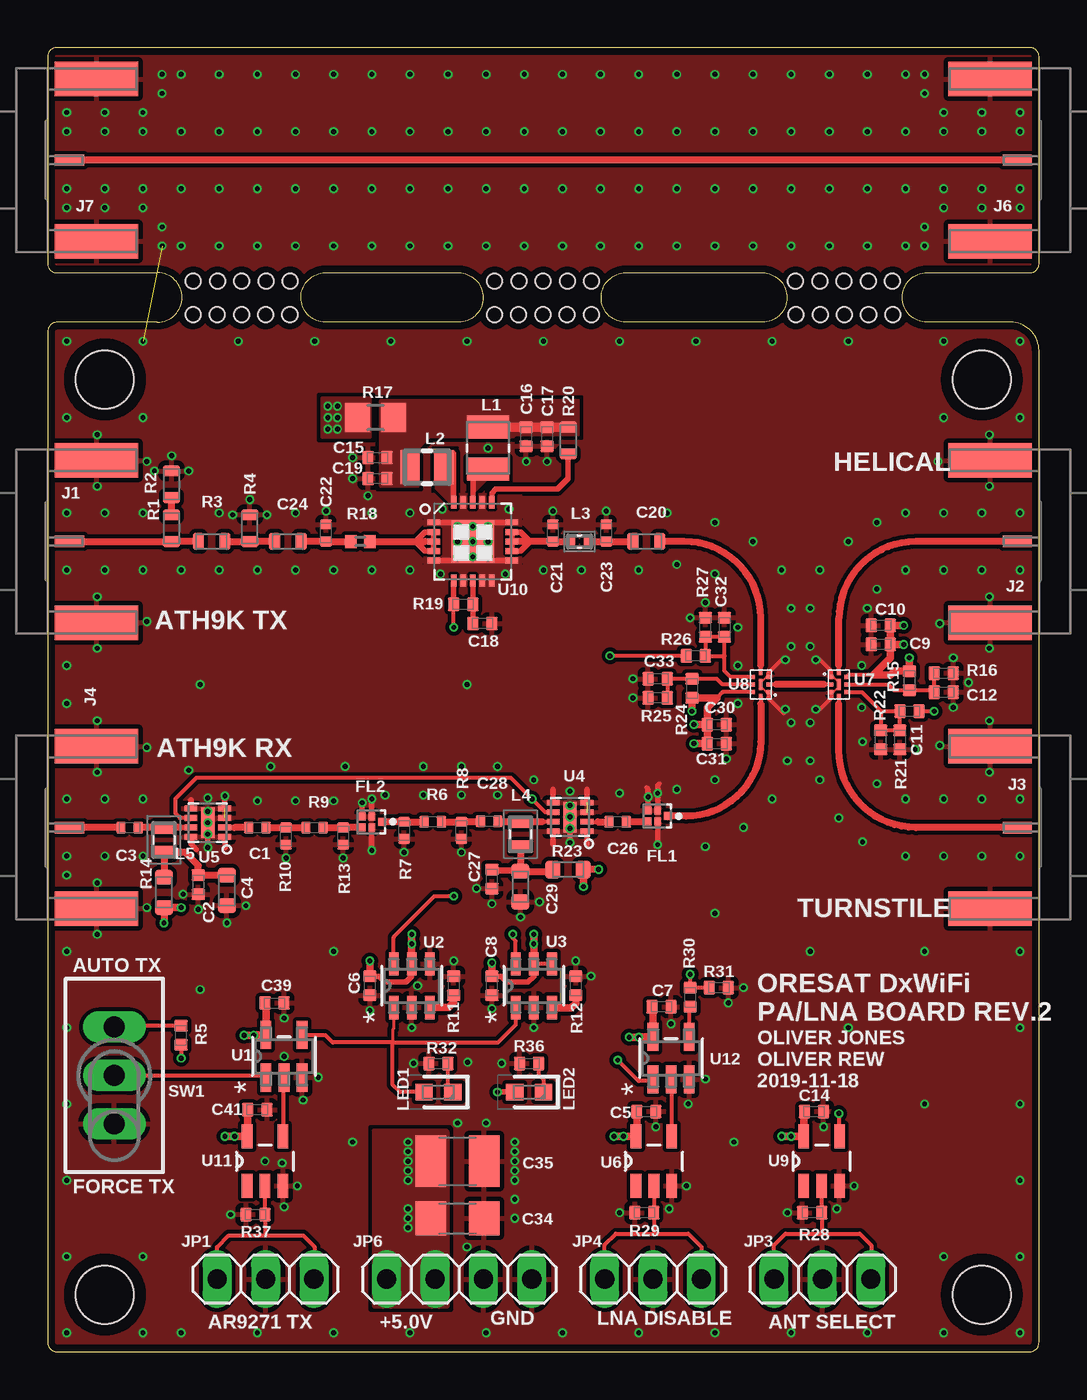
[diagram p6: board, top side]
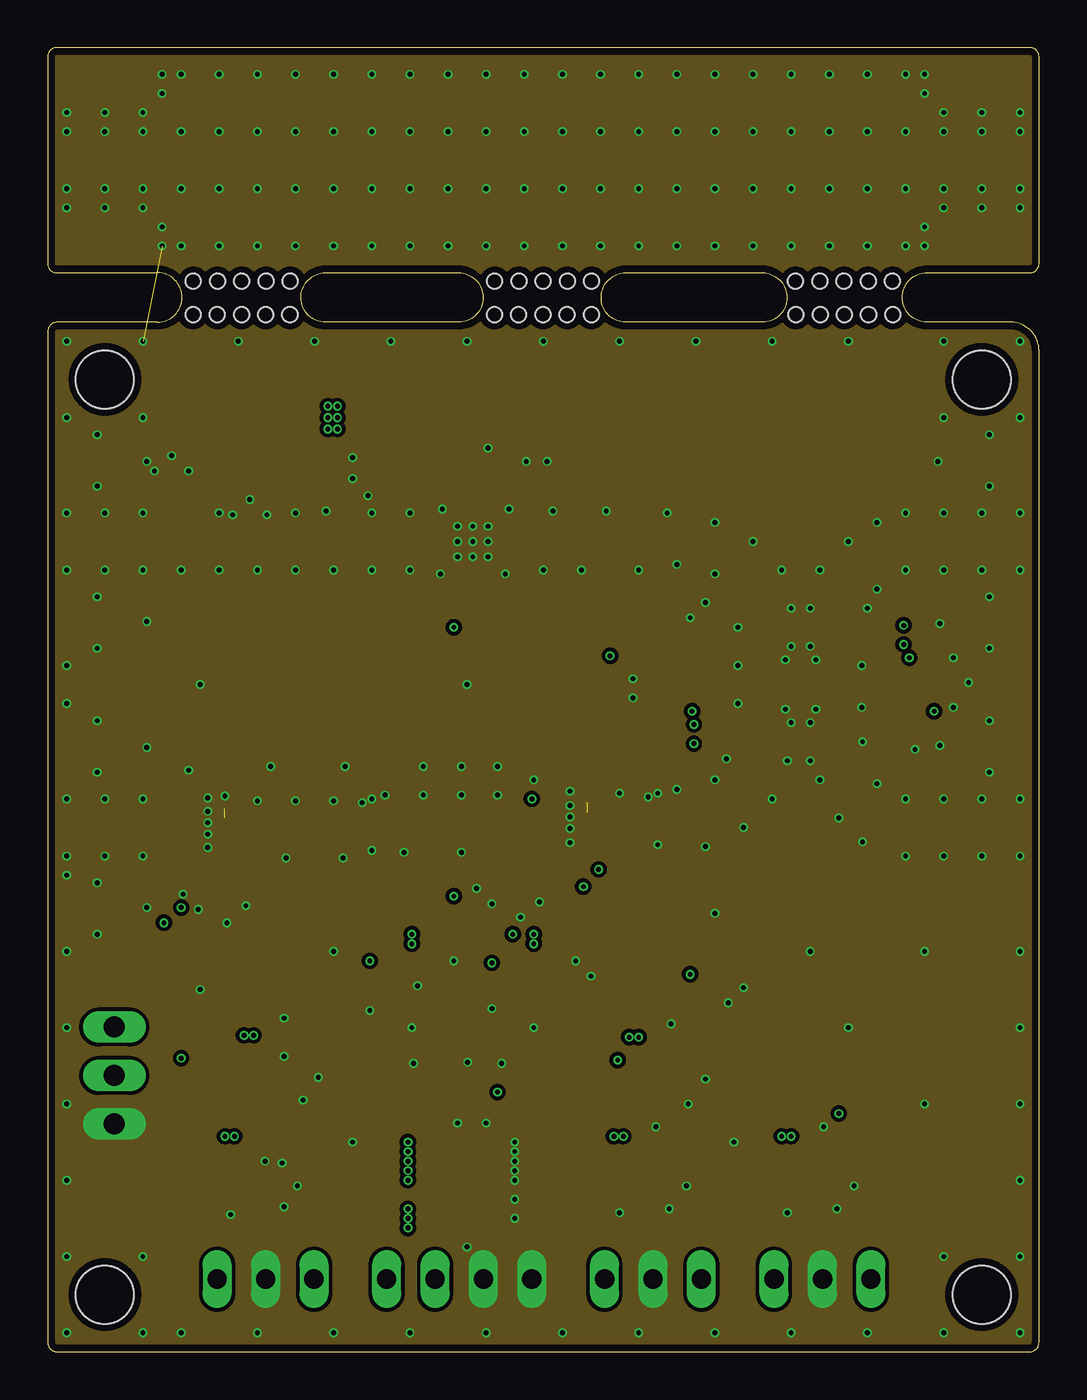
[diagram p7: board, inner layer Route2]
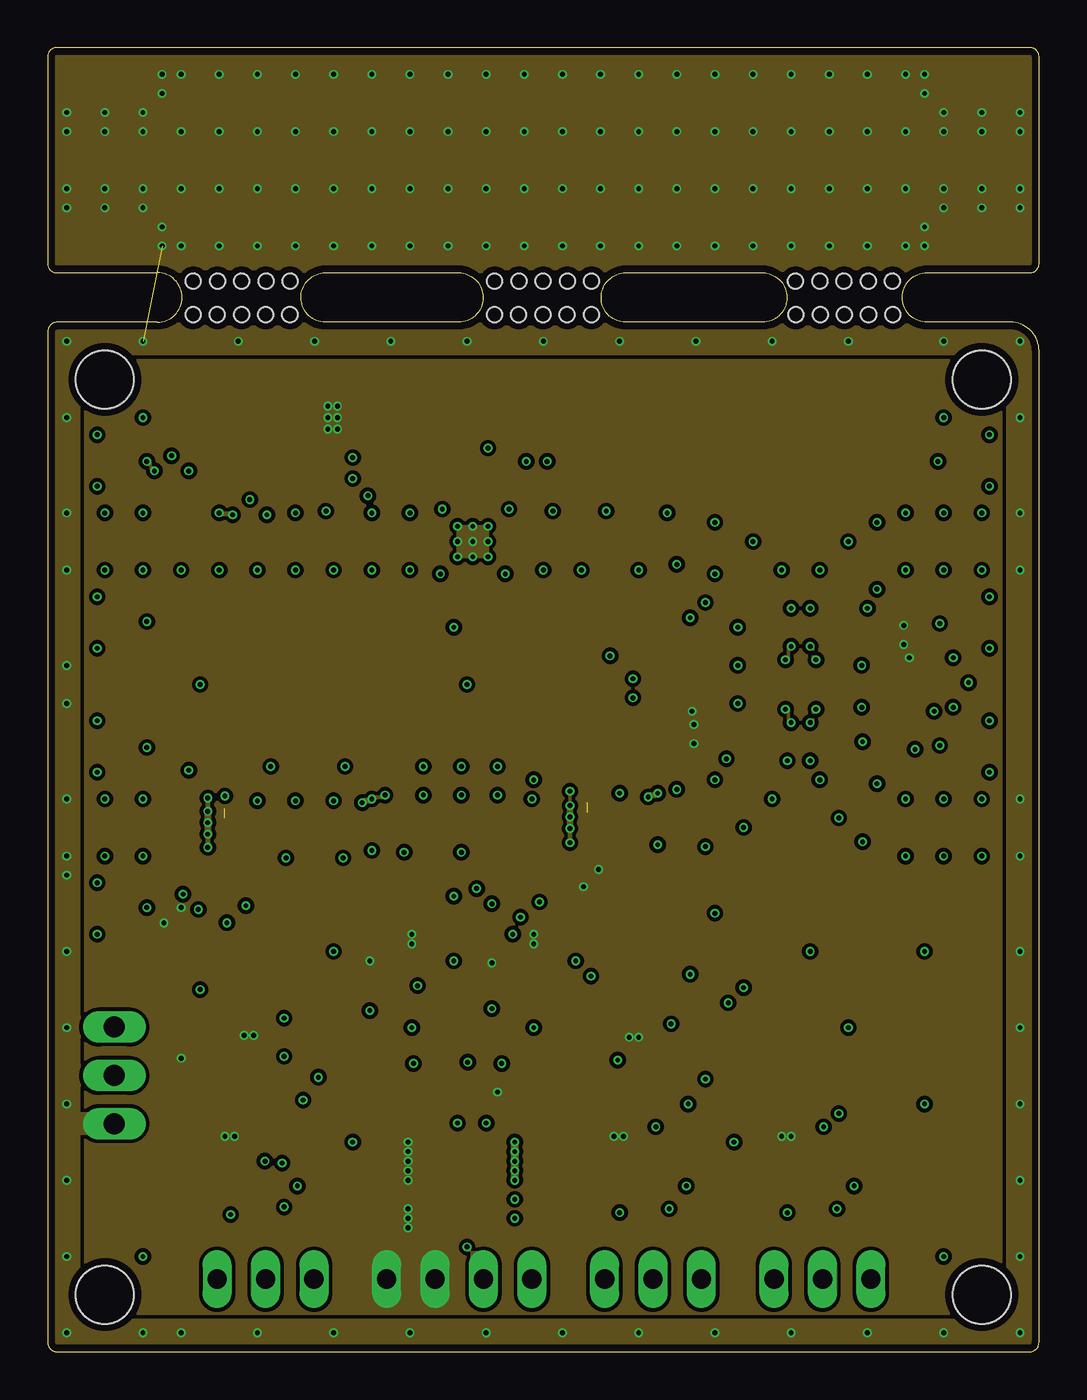
[diagram p8: board, inner layer Route15]
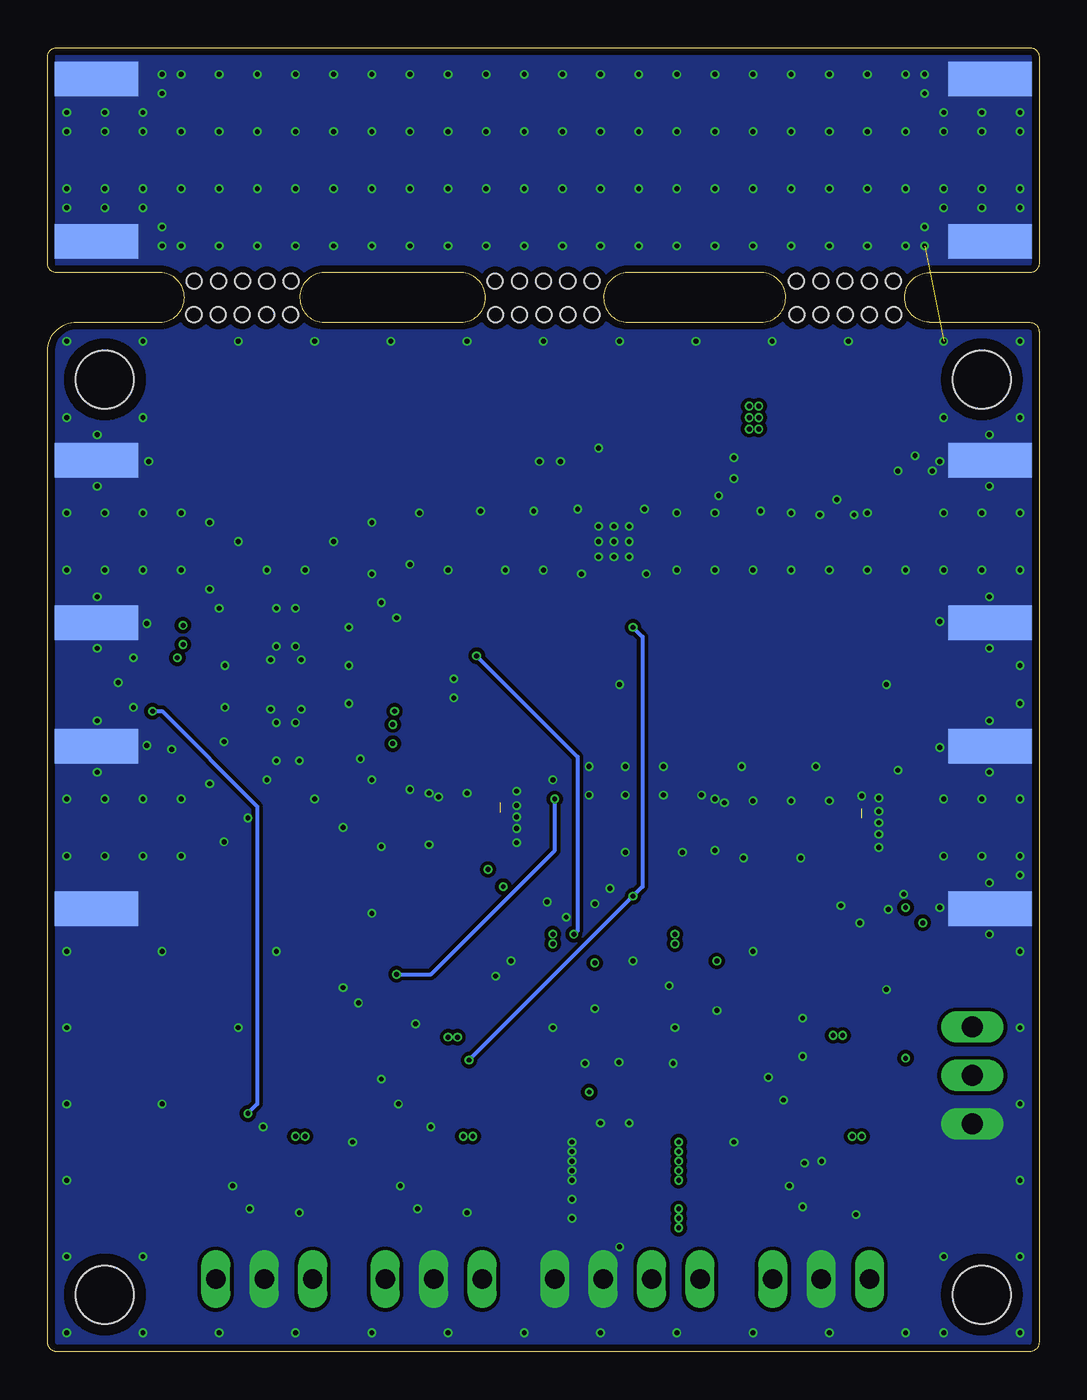
[diagram p9: board, bottom side, seen from below]

Size 52 x 68.4 mm. Coordinates in mm from the lower left corner, seen from the top.
Outline: 0,53.5 0,0.5 arc90 0.5,0 51.5,0 arc90 52,0.5 52,52.5 arc90 50.5,54 46.12,54 arc-180 46.12,56.6 51.5,56.6 arc90 52,57.05 52,67.95 arc90 51.5,68.4 0.5,68.4 arc90 0,67.95 0,57.05 arc90 0.5,56.6 5.75,56.6 arc-180 5.75,54 0.5,54 arc90 0,53.5
Outline: 30.31,54 arc-90 29.04,55.27 arc-90 30.31,56.6 37.5,56.6 arc-90 38.77,55.27 arc-90 37.5,54 30.31,54
Outline: 14.56,54 arc-90 13.29,55.27 arc-90 14.56,56.6 21.56,56.6 arc-90 22.84,55.27 arc-90 21.56,54 14.56,54
Copper layers (1*2*15*16): Top 0.035559375mm / dielectric 0.17018125mm / Route2 0.01778125mm / dielectric 47mil / Route15 0.01778125mm / dielectric 0.17018125mm / Bottom 0.035559375mm
Design rules "oshpark-4layer-tented": minimum track width 5mil, minimum drill 10mil, track to track 5mil, track to pad 5mil, pad to pad 5mil, via to via 5mil, smd to smd 5mil, copper to edge 15mil, drill to drill 6mil, minimum pad ring 4mil, minimum via ring 4mil, stop-mask expansion 2.5mil, vias tented up to drill 20mil, thermal gap 10mil
Holes 0.79 mm at 7.62,54.41 8.89,54.41 10.16,54.41 11.44,54.41 12.71,54.41 7.64,56.15 8.91,56.15 10.18,56.15 11.45,56.15 12.72,56.15 23.44,54.41 24.71,54.41 25.98,54.41 27.25,54.41 28.52,54.41 23.45,56.15 24.72,56.15 25.99,56.15 27.26,56.15 28.53,56.15 39.25,54.41 40.52,54.41 41.79,54.41 43.06,54.41 44.33,54.41 39.23,56.15 40.5,56.15 41.77,56.15 43.04,56.15 44.31,56.15

### Footprints (pad centres in the part's own frame; a part is rotated, then mirrored left to right if it is on the bottom)
.0402-C-NOSILK = smd 0.5 x 0.6: 1 -0.45,0; 2 0.45,0
.0402-B-NOSILK = smd 0.6 x 0.7: 1 -0.5,0; 2 0.5,0
.0603-B-NOSILK = smd 0.8 x 0.95: 1 -0.8,0; 2 0.8,0
.0603-C-NOSILK = smd 0.6 x 0.9: 1 -0.7,0; 2 0.7,0
C1206 = smd 1.6 x 1.8: 1 -1.4,0; 2 1.4,0
C1210 = smd 1.6 x 2.7: 1 -1.4,0; 2 1.4,0
FIL_B39162B9417K610 = smd 0.35 x 0.425: 1 -0.5,0; 2 0,-0.287; 3 0.5,-0.287; 4 0.5,0.287; 5 0,0.287
STAND-OFF-TIGHT = hole 3.048: 0,0
142-0701-851 = smd 1.8 x 4.37: GND1 -4.255,-2.566; GND2 4.255,-2.566 | smd 1.8 x 4.37 bottom: GND3 -4.255,-2.566; GND4 4.255,-2.566 | smd 0.6 x 1.53: RF1 0,-1.146
1X03 = drill 1.016 long: 1 -2.54,0; 2 0,0; 3 2.54,0
1X04 = drill 1.016 long: 1 -3.81,0; 2 -1.27,0; 3 1.27,0; 4 3.81,0
INDC2520X120N = smd 1.2 x 2.22: 1 -1.11,0; 2 1.11,0
0805CS = smd 1.78 x 1.02: 1 0,-0.89; 2 0,0.89
0402CS1N2XJLW = smd 0.66 x 0.36: 1 0,0.41; 2 0,-0.41
0603CS-68NXJLW = smd 1.02 x 0.64: 1 0,0.64; 2 0,-0.64
LEDC1607X80N = smd 0.9 x 0.85: 1 -0.75,0; 2 0.75,0
R0805 = smd 1.3 x 1.5: 1 -0.95,0; 2 0.95,0
R0402 = smd 0.6 x 0.7: 1 -0.5,0; 2 0.5,0
TL3XPO = drill 1.1 pad 1.422 long: 1 -2.54,0; 2 0,0; 3 2.54,0
DBV5 = smd 1.473 x 0.559: 1 -1.118,0.95; 2 -1.118,0; 3 -1.118,-0.95; 4 1.118,-0.95; 5 1.118,0.95
TSOT-23_S6 = smd 1.219 x 0.508: 1 -1.143,0.95; 2 -1.143,0; 3 -1.143,-0.95; 4 1.143,-0.95; 5 1.143,0; 6 1.143,0.95
DFN8-2X2-WITH-PAD = smd 0.3 x 0.67: 1 -0.75,-0.885; 2 -0.25,-0.885; 3 0.25,-0.885; 4 0.75,-0.885; 5 0.75,0.885; 6 0.25,0.885; 7 -0.25,0.885; 8 -0.75,0.885 | smd 1.6 x 0.7: PAD 0,0
SOT95P280X145-5N = smd 1.27 x 0.559: 1 -1.295,0.94; 2 -1.295,0; 3 -1.295,-0.94; 4 1.295,-0.94; 5 1.295,0.94
QPC1022 = smd 0.2 x 0.2: 1 -0.4,0.4; 2 -0.4,0; 3 -0.4,-0.4; 4 0,-0.6; 5 0.4,-0.4; 6 0.4,0; 7 0.4,0.4; 8 0,0.6 | smd 0.2 x 0.6: 9 0,0
QFN50P400X400X102-21N = smd 0.65 x 0.3: 1 -2.05,1; 2 -2.05,0.5; 3 -2.05,0; 4 -2.05,-0.5; 5 -2.05,-1; 11 2.05,-1; 12 2.05,-0.5; 13 2.05,0; 14 2.05,0.5; 15 2.05,1 | smd 0.3 x 0.65: 6 -1,-2.05; 7 -0.5,-2.05; 8 0,-2.05; 9 0.5,-2.05; 10 1,-2.05; 16 1,2.05; 17 0.5,2.05; 18 0,2.05; 19 -0.5,2.05; 20 -1,2.05 | smd 2.25 x 2.25: 21 0,0

### Placement (x,y rotation side)
C1  11,27.5 180 top
C2  7.9,24.5 90 top
C3  4.3,27.5 180 top
C4  9.4,24.2 270 top
C5  31.4,12.6 0 top
C6  16.9,19.2 270 top
C7  32.2,18.1 0 top
C8  23.3,19.2 270 top
C9  43.7,37.1 180 top
C10  43.7,38.1 180 top
C11  44.7,32.1 270 top
C12  47,34.6 0 top
C14  40.2,12.6 0 top
C15  17.3,46.9 180 top
C16  25.1,48 270 top
C17  26.2,48 270 top
C18  22.8,38.2 0 top
C19  17.3,45.8 180 top
C20  31.4,42.5 0 top
C21  26.5,42.95 90 top
C22  14.6,42.95 90 top
C23  29.3,42.95 90 top
C24  12.6,42.5 0 top
C26  29.9,27.8 180 top
C27  23.3,24.8 90 top
C28  23.15,27.83 180 top
C29  24.8,24.4 270 top
C30  35.1,32.9 0 top
C31  35.1,31.9 0 top
C32  35.5,38 90 top
C33  32,35.3 180 top
C34  21.5,7 0 top
C35  21.5,10 0 top
C39  11.9,18.3 0 top
C41  11,12.7 0 top
FL1  32,28.1 180 top
FL2  17,27.8 180 top
H1  49,51 90 top
H2  49,3 90 top
H3  3,3 90 top
H4  3,51 90 top
J1  0,42.5 90 top
J2  52,42.5 270 top
J3  52,27.5 270 top
J4  0,27.5 90 top
J6  52,62.5 270 top
J7  0,62.5 90 top
JP1  11.43,3.81 180 top
JP3  40.64,3.81 0 top
JP4  31.75,3.81 0 top
JP6  21.59,3.81 0 top
L1  23.1,47.4 90 top
L2  19.9,46.4 90 top
L3  27.9,42.5 90 top
L4  24.8,27.15 0 top
L5  6.1,26.85 0 top
LED1  20.5,13.62 180 top
LED2  25.25,13.62 180 top
R1  6.5,43.2 270 top
R2  6.5,45.5 270 top
R3  8.6,42.5 0 top
R4  10.6,43.2 90 top
R5  7,16.6 270 top
R6  20.2,27.8 180 top
R7  18.7,27.35 270 top
R8  21.7,27.35 270 top
R9  14,27.5 180 top
R10  12.5,27.05 270 top
R11  21.3,19.2 270 top
R12  27.7,19.2 270 top
R13  15.5,27.05 270 top
R14  6.1,24.1 270 top
R15  45.2,35.2 270 top
R16  47,35.6 0 top
R17  17.2,49 180 top
R18  16.4,42.5 0 top
R19  21.8,39.2 0 top
R20  27.3,47.8 90 top
R21  45.2,33.6 180 top
R22  43.7,32.1 270 top
R23  27.3,25.3 0 top
R24  33.8,34.8 90 top
R25  32,34.3 180 top
R26  34,36.5 0 top
R27  34.5,38 90 top
R28  40.1,7.3 0 top
R29  31.3,7.3 0 top
R30  33.7,18.6 270 top
R31  35.2,19.1 0 top
R32  20.5,15.12 0 top
R36  25.25,15.12 0 top
R37  10.9,7.2 0 top
SW1  3.5,14.5 90 top
U1  12.4,15.5 90 top
U2  19.1,19.2 90 top
U3  25.5,19.2 90 top
U4  TQP3M9037  [DFN8-2X2-WITH-PAD]  27.4,28.05 90 top
U5  TQP3M9037  [DFN8-2X2-WITH-PAD]  8.4,27.75 90 top
U6  31.8,10 90 top
U7  41.5,35 0 top
U8  37.4,35 180 top
U9  40.6,10 90 top
U10  22.3,42.5 0 top
U11  11.4,10 90 top
U12  32.7,15.4 90 top

### Tracks (layer width: path | path; a pad name or v marks a point on that pad's centre or on a via)
+5V  (via drill 0.25)
  Top 0.2: 43.3,35.5 42,35.5 U7.7 | 39.66,12.56 C14.1 | U9.5 | 35.1,34.3 35.4,34.6 U8.7 | 30.9,11.34 U6.5 | v30.2,11.3 v30.2,11.29 | R5.2 v7,15.4 | C39.1 11.45,18.25 | C7.1 31.75,18.05 | U3.4 U3.5
  Top 0.3: LED2.2 v23.59,13.62 | U3.5 25.5,19.7 25.2,19.4 24.1,19.4 23.8,19.7 C8.1 | U2.5 19.1,19.7 18.8,19.4 17.7,19.4 17.4,19.7 C6.1
  Top 0.38: v28.9,25.3 R23.2 | R14.2 v6.1,22.5
  Top 0.4: C9.1 44.2,36.4 43.3,35.5 44.2,35.5 44.4,35.7 R15.1 v45.2,36.4 | C9.1 C10.1 v44.9,38.1 | v44.9,37.1 C9.1 | U9.5 39.66,12.56 | U9.5 v39,11.3 v38.5,11.3 | C30.1 C31.1 v33.9,31.9 | C30.1 34.6,33.8 35.1,34.3 R24.1 v33.8,33.6 | C5.1 30.9,11.34 | v30.2,11.29 U6.5 | 11.45,18.25 U1.5 10.82,16.62 v10.8,16.6 v10.3,16.6 | 31.75,18.05 U12.5 31.02,16.52 v31,16.5 v30.5,16.5 | U3.5 v25.5,21.4 v25.5,21.9 | U2.5 v19.1,21.4 v19.1,21.9 | v29.7,11.3 v30.2,11.3 | v9.3,11.3 v9.8,11.3 U11.5 10.5,11.34 C41.1 | v23.3,20.4 C8.1 | v16.9,20.5 C6.1 | v7,23.3 R14.2 | v28.1,24.4 R23.2 | v33.9,32.9 C30.1
  other vias: 15.2,49.6 18.9,6.5 18.9,7 18.9,7.5 18.9,9 18.9,9.5 18.9,10 18.9,10.5 18.9,11 15.2,49 15.2,48.4 14.7,49 14.7,49.6 14.7,48.4
  pour Route15 (isolate 0.2, rank 2, no thermals): 50,52 50,2 2,2 2,52
  pour Top (no thermals): 21,2.4 21,11.5 20.9,11.6 17.1,11.6 17.1,2.4
  pour Top (no thermals): 16.9,48 16.9,50 14.4,50 14.4,48
ANT_SEL+3.3V
  Top 0.2: U9.2 R28.2 40.6,6.2 | JP3.1 38.1,5.6 38.7,6.2 40.6,6.2 | 40.6,6.2 42.6,6.2 43.2,5.6 43.2,3.83 JP3.3
ANT_SEL_+5.0V  (via drill 0.25)
  Top 0.2: R21.1 v46.5,33.6 | U9.4 41.54,12.46 v41.5,12.5
  Bottom 0.2: v46.5,33.6 46,33.6 41,28.6 41,13 v41.5,12.5
AR9271_TX_+3.3V
  Top 0.2: JP1.3 8.89,5.49 9.5,6.1 11.4,6.1 | 11.4,6.1 13.4,6.1 14,5.5 14,3.84 JP1.1 | 11.4,6.1 R37.2 U11.2
AS-CTRL
  Top 0.2: U7.5 42.7,34.6 43.7,33.6 | 43.7,33.6 R22.1 C11.1 R21.2 43.7,33.6
AS-EN
  Top 0.2: U7.6 44.1,35 44.4,34.7 R15.2 46.4,34.7 C12.1 R16.1
GND  (via drill 0.25, 0.25 pad 0)  (3 unrouted)
  Top 0.127: U8.1 37.7,34.6 37.4,34.9 U8.9 37.4,35.1 37.7,35.4 U8.3 | U7.1 41.2,35.4 41.5,35.1 U7.9 41.5,34.9 41.2,34.6 U7.3
  Top 0.2: U7.1 41.1,35.7 40.5,36.3 v40.3,36.3 | U7.3 41.1,34.3 40.5,33.7 v40.3,33.7 | U8.3 37.8,35.6 38.6,36.4 | U8.1 37.8,34.3 38.6,33.5 | v32,26.6 arc-90 31.9,26.5 | 32,29.7 arc-90 32.1,29.8 | 31.5,29.5 arc90 31.4,29.6
  Top 0.3: FL1.5 v32,26.6 | FL1.2 32,29.7 | FL1.3 31.5,29.5 | FL2.3 v16.5,28.8 | FL2.2 17,29.1 | FL2.5 v17,26.3 | U4.PAD v27.4,26.7 | U5.PAD v8.4,26.45 | U5.1 9.3,26.98 9.3,26.45 | 7.8,26.35 7.51,26.64 U5.8 | U5.4 9.29,29.14 v9.3,29.15 | U5.5 7.51,28.93 7.5,28.95 | U4.8 26.52,26.61 26.5,26.6 | U4.1 28.29,26.61 28.3,26.6 | U4.4 28.29,29.48 28.3,29.5 | U4.5 26.52,29.48 26.5,29.5 | U10.5 21.3,41.5 v21.5,41.7 | U10.11 23.3,41.5 v23.1,41.7 | U10.15 23.3,43.5 v23.1,43.3 | U10.1 21.3,43.5 v21.5,43.3
  other vias: 24.5,11 23.81,15.12 3,64 7,64 5,64 35,64 33,64 31,64 29,64 27,64 25,64 23,64 21,64 19,64 17,64 15,64 13,64 1,64 9,64 11,64 7,61 5,61 1,61 3,61 19.19,15.12 22.03,15.19 37,64 39,64 41,64 43,64 45,64 47,64 49,64 51,64 51,61 49,61 47,61 45,61 43,61 41,61 39,61 37,61 35,61 33,61 31,61 29,61 27,61 25,61 23,61 21,61 19,61 17,61 15,61 13,61 11,61 9,61 1,60 3,60 5,60 6,59 6,58 6,67 6,66 5,65 3,65 1,65 51,65 49,65 47,65 46,66 46,67 51,60 49,60 47,60 46,59 46,58 43,39 42.7,36 42.7,33.8 38.7,36.3 38.7,33.7 36.2,34 36.2,36 8.4,27.75 1,1 51,1 51,53 1,53 9,67 11,67 13,67 15,67 17,67 19,67 21,67 23,67 25,67 27,67 29,67 31,67 33,67 35,67 37,67 39,67 41,67 43,67 7,67 7,58 45,67 45,58 43,58 41,58 39,58 37,58 35,58 33,58 31,58 29,58 27,58 25,58 23,58 21,58 19,58 17,58 15,58 13,58 11,58 9,58 5,53 10,53 14,53 18,53 22,53 26,53 30,53 34,53 38,53 42,53 47,53 1,49 51,49 47,49 5,49 1,44 3,44 5,44 1,41 3,41 5,41 7,41 9,41 11,41 13,41 15,41 17,41 19,41 9,44 13,44 14.6,44.1 19,44 1,5 5,5 5,1 51,5 47,5 47,1 43,1 39,1 35,1 31,1 27,1 23,1 19,1 15,1 11,1 7,1 51,9 51,13 51,17 51,21 51,29 51,41 1,9 1,13 1,17 1,21 1,25 1,29 17,44 20.6,40.8 24,40.8 20.7,44.2 24.2,44.2 22.3,42.5 27.4,29.4 27.4,28.05 8.4,29.05 27.4,28.65 27.4,27.45 8.4,28.35 8.4,27.15 22.3,43.3 21.5,42.5 23.1,42.5 22.3,41.7 24.5,10.5 24.5,10 23,12 24.5,7 24.5,8 24.5,9 24.5,9.5 21.5,12 22,5.5 9.6,7.2 12.4,7.6 13.1,8.7 19.1,17 11.4,10 12.3,9.9 13.4,13.2 14.2,14.4 12.4,15.5 12.4,17.5 25.5,17 19.4,19.2 16.9,17.9 23.3,18 21.3,20.5 27.7,20.5 30,7.3 38.8,7.3 42.3,8.7 33.5,8.7 32.6,7.5 41.4,7.5 40.7,11.8 31.9,11.8 34.5,14.3 33.6,13 32.7,17.2 36.5,19.1 35.7,18.3 28.5,19.7 45.5,31.6 47.5,33.8 47.5,36.4 48.3,35.1 49,41 47,41 45,41 43.5,40 49,29 47,29 45,29 42.75,32 49.4,30.4 46.8,31.8 49.4,33.1 49.4,36.9 46.8,38.2 49.4,39.6 49.4,45.4 49.4,48.1 46.7,46.7 51,44 49,44 47,44 45,44 43.5,43.5 42,42.5 40.5,41 40,39 40,37 39,37 39,39 38.5,41 37,42.5 35,43.5 32.5,44 51,26 49,26 47,26 45,26 43.5,29.8 42.75,26.75 41.5,28 40.5,30 40,31 40,33 39,33 38.8,31 38,29 36.5,27.5 34.5,26.5 33.7,38.5 30.7,35.3 30.7,34.3 35.6,31.1 26.2,46.7 25.1,46.7 16,45.8 16,46.9 23.1,47.4 2.6,48.1 5.2,46.7 2.6,45.4 2.6,39.6 5.2,38.3 2.6,36.9 2.6,33.1 5.2,31.7 2.6,30.4 2.6,24.6 5.2,23.3 2.6,21.9 1,26 3,26 3,29 5,29 5,26 7.1,24 7.9,23.2 10.4,23.4 9.4,22.5 12.5,25.9 15.5,25.9 18.7,26.2 21.7,26.2 22.5,24.3 23.3,23.5 24.8,22.8 25.8,23.6 17,29 32,29.3 31.5,29.1 6.5,47 7.4,46.2 5.6,46.2 10.6,44.7 9.7,43.9 11.5,43.9 26.5,44.1 29.3,44.1 34.5,39.3 36.2,38 35,40.8 33,41.3 31,41 28,41 26,41 35,30 33,29.5 30,29.3 25.5,30 23.6,30.7 21.7,30.7 19.7,30.7 23.6,29.2 21.7,29.2 19.7,29.2 17.7,29.2 15,28.9 13,28.9 11,28.9 7.4,30.5 11.7,30.7 15.6,30.7 46,13 46,21 40,21 36,11 35,23 42,17 15,21 8,19 16,11 16.8,44.9 1,34 1,36 8,35 22,35
  pour Route2 (isolate 0.2, no thermals): 0,68.4 52,68.4 52,0 0,0
  pour Bottom (isolate 0.2, rank 2, no thermals): 0,68.4 52,68.4 52,0 0,0
  pour Top (isolate 0.2, rank 5): 0,0 0,68.4 52,68.4 52,0
  pour Top (rank 3, no thermals): 19.8,45 24.8,45 24.8,39.8 19.8,39.8
  pour Route15 (isolate 0.2, rank 6, no thermals): 52,68.4 52,0 0,0 0,68.4
HELICAL
  Top 0.2: U7.8 41.5,36
  Top 0.38: J2.RF1 45.54,42.5 arc90 41.5,38.46 41.5,36
LNA_DISABLE+3.3V
  Top 0.2: U6.2 R29.2 31.8,6.2 | JP4.1 29.21,5.61 29.8,6.2 31.8,6.2 | 31.8,6.2 33.6,6.2 34.3,5.5 JP4.3
LNA_DISABLE_+5.0V
  Top 0.2: U12.2 32.74,14.24 U6.4
LNA_ON_OFF  (via drill 0.25)
  Top 0.2: U4.6 26.1,28.3 v25.4,29 24.3,30.1 7.8,30.1 6.7,29 6.7,28.25 6.95,28 U5.6 | v33.7,19.8 R30.1 R31.1
  Bottom 0.2: v33.7,19.8 31.9,19.8 25.4,26.3 v25.4,29
N$1
  Top 0.38: R6.1 R8.1 21.71,27.82 C28.2
N$2
  Top 0.38: J1.RF1 R1.2 R3.1
N$3
  Top 0.2: R5.1 3.06,17.1 SW1.3
N$4
  Top 0.38: R1.1 R2.2
N$5
  Top 0.2: SW1.2 11.33,14.5 U1.1
N$6
  Top 0.3: FL2.4 16.49,27.5
  Top 0.38: R9.1 R13.1 16.49,27.5
N$7
  Top 0.3: U5.2 9.8,27.5
  Top 0.38: C1.2 9.8,27.5
N$8
  Top 0.3: U5.7 6.95,27.5
  Top 0.38: 6.95,27.5 L5.1 C3.1
N$9
  Top 0.38: R14.1 L5.2 7.19,26.21 7.9,25.5 C2.2 C4.1
N$10
  Top 0.152: U2.1 18.15,16.95 18.1,16.9 18.1,16.22
  Top 0.2: U1.4 14.55,16.62 14.95,16.22 18.1,16.22 | 18.1,16.22 23.62,16.22 24.55,17.15 U3.1 | LED1.2 18.48,13.62 18.1,14 18.1,16.22
N$11
  Top 0.4: U2.3 21.02,18.06 21.3,18.34 R11.2
N$12
  Top 0.38: C3.2 J4.RF1
N$13
  Top 0.2: U1.2 12.34,14.32 U11.4
N$14
  Top 0.4: R12.2 27.7,18.27 27.46,18.04 26.47,18.04 U3.3
N$15
  Top 0.2: LED1.1 21,13.88 R32.2
N$16
  Top 0.3: U10.18 22.3,46.2
  pour Top (no thermals): 22.3,45.1 23.4,46.2 22.2,46.2 22.3,46.1
N$17
  Top 0.2: U12.4 33.65,18.05 R30.2
N$21
  Top 0.5: R20.2 C17.1 C16.1 L1.2
  pour Top (no thermals): 27.8,49.9 27.8,48.1 24.5,48.1 24.39,47.99 20,47.99 19.4,47.4 19.4,45.4 17.5,45.4 17.5,49.9
N$22
  Top 0.3: U10.8 R19.2 C18.1
N$24
  Top 0.3: U10.14 U10.13 U10.12 24.8,42 25.3,42.5 24.8,43 U10.14
  Top 0.38: U10.13 C21.1 L3.1
N$25
  Top 0.38: C24.2 C22.1 R18.1
N$26
  Top 0.2: U4.2 28.85,27.8
  Top 0.38: 28.85,27.8 C26.2
N$27
  Top 0.38: L3.2 C23.1 C20.1
N$28
  Top 0.2: U4.7 25.95,27.8
  Top 0.38: 25.95,27.8 24.85,27.8 24.82,27.82 24.77,27.82 | 24.77,27.82 L4.1 | C28.1 24.77,27.82
N$29
  Top 0.38: L4.2 24.8,25.23 23.35,25.25 C27.2 | R23.1 26.4,25.2 C29.1
  Top 0.4: C29.1 | C29.1 24.8,25.23
N$30
  Top 0.3: U10.16 23.3,45.05 23.5,45.25 26.75,45.25 27.3,45.8 R20.1
N$31
  Top 0.3: U10.20 21.3,47.1 20.79,46.59 L2.1
  pour Top (no thermals): 21.3,44.5 21.3,47.2 20.4,47.2 20.4,45.3 21.2,44.5
N$33
  Top 0.2: 31.4,27.81 31.49,27.8 FL1.4
  Top 0.38: C26.1 30.5,27.8 30.6,27.81 31.4,27.81
N$51
  Top 0.2: R36.2 25.75,14.55 26,14.3 LED2.1
N$56
  Top 0.2: 19.8,42.5 U10.3
  Top 0.3: U10.2 U10.3 U10.4 19.8,42 19.3,42.5 19.8,43 U10.2
  Top 0.38: R18.2 19.3,42.5 19.8,42.5
PA_MATCH_OUT
  Top 0.2: U8.4 37.4,36
  Top 0.38: 37.4,36 37.4,38.5 arc90 33.4,42.5 C20.2
PA_ON_LNA_OFF  (via drill 0.25)
  Top 0.2: U12.1 31.67,14.2 31,14.2 v29.9,15.3 | v21.3,23.9 20.3,23.9 18.15,21.75 U2.6 | v21.3,38 R19.1
  Top 0.3: U10.6 R19.1
  Bottom 0.2: v21.3,38 20.8,37.5 20.8,24.4 v21.3,23.9 v29.9,15.3
PA_PAD_OUT
  Top 0.38: R3.2 R4.1 C24.1
PA_PAD_OUT1
  Top 0.3: FL2.1 17.55,27.8
  Top 0.38: 17.55,27.8 R7.1 R6.2
PA_PAD_OUT2
  Top 0.38: C1.1 R10.1 R9.2
RX_IN
  Top 0.2: U8.8 37.4,34 | 32.7,28.1 FL1.1
  Top 0.38: 37.4,34 37.4,32 arc-90 33.5,28.1 32.7,28.1
THROUGH
  Top 0.38: J6.RF1 J7.RF1
TURNSTILE
  Top 0.2: U7.4 41.5,34
  Top 0.38: J3.RF1 45.54,27.5 arc-90 41.5,31.54 41.5,34
TX_RX_COMMON
  Top 0.2: U7.2 40.7,35 | 38.2,35 U8.2
  Top 0.38: 40.7,35 38.2,35
TX_RX_CTL  (via drill 0.25)
  Top 0.2: R26.1 v29.5,36.5 | U3.6 24.55,21.55 24.4,21.7 v24.4,21.9
  Bottom 0.2: v29.5,36.5 24.2,31.2 24.2,22.1 v24.4,21.9
TXRX-CTRL
  Top 0.2: U8.5 35.8,35.4 35.5,35.7 35.5,36.5 | 35.5,36.5 C32.1 R27.1 R26.2 35.5,36.5
TXRX-EN
  Top 0.2: U8.6 35.4,35 35.1,35.3 R24.2 C33.1 R25.1

### Text on the board
tPlace: HELICAL | ATH9K TX | ATH9K RX | TURNSTILE | AUTO TX | ORESAT DxWiFi / PA/LNA BOARD REV.2 | OLIVER JONES / OLIVER REW / 2019-11-18 | FORCE TX | AR9271 TX | +5.0V | GND | LNA DISABLE | ANT SELECT